# EAGLE board MainECU rev11 (EAGLE 9.6.2)
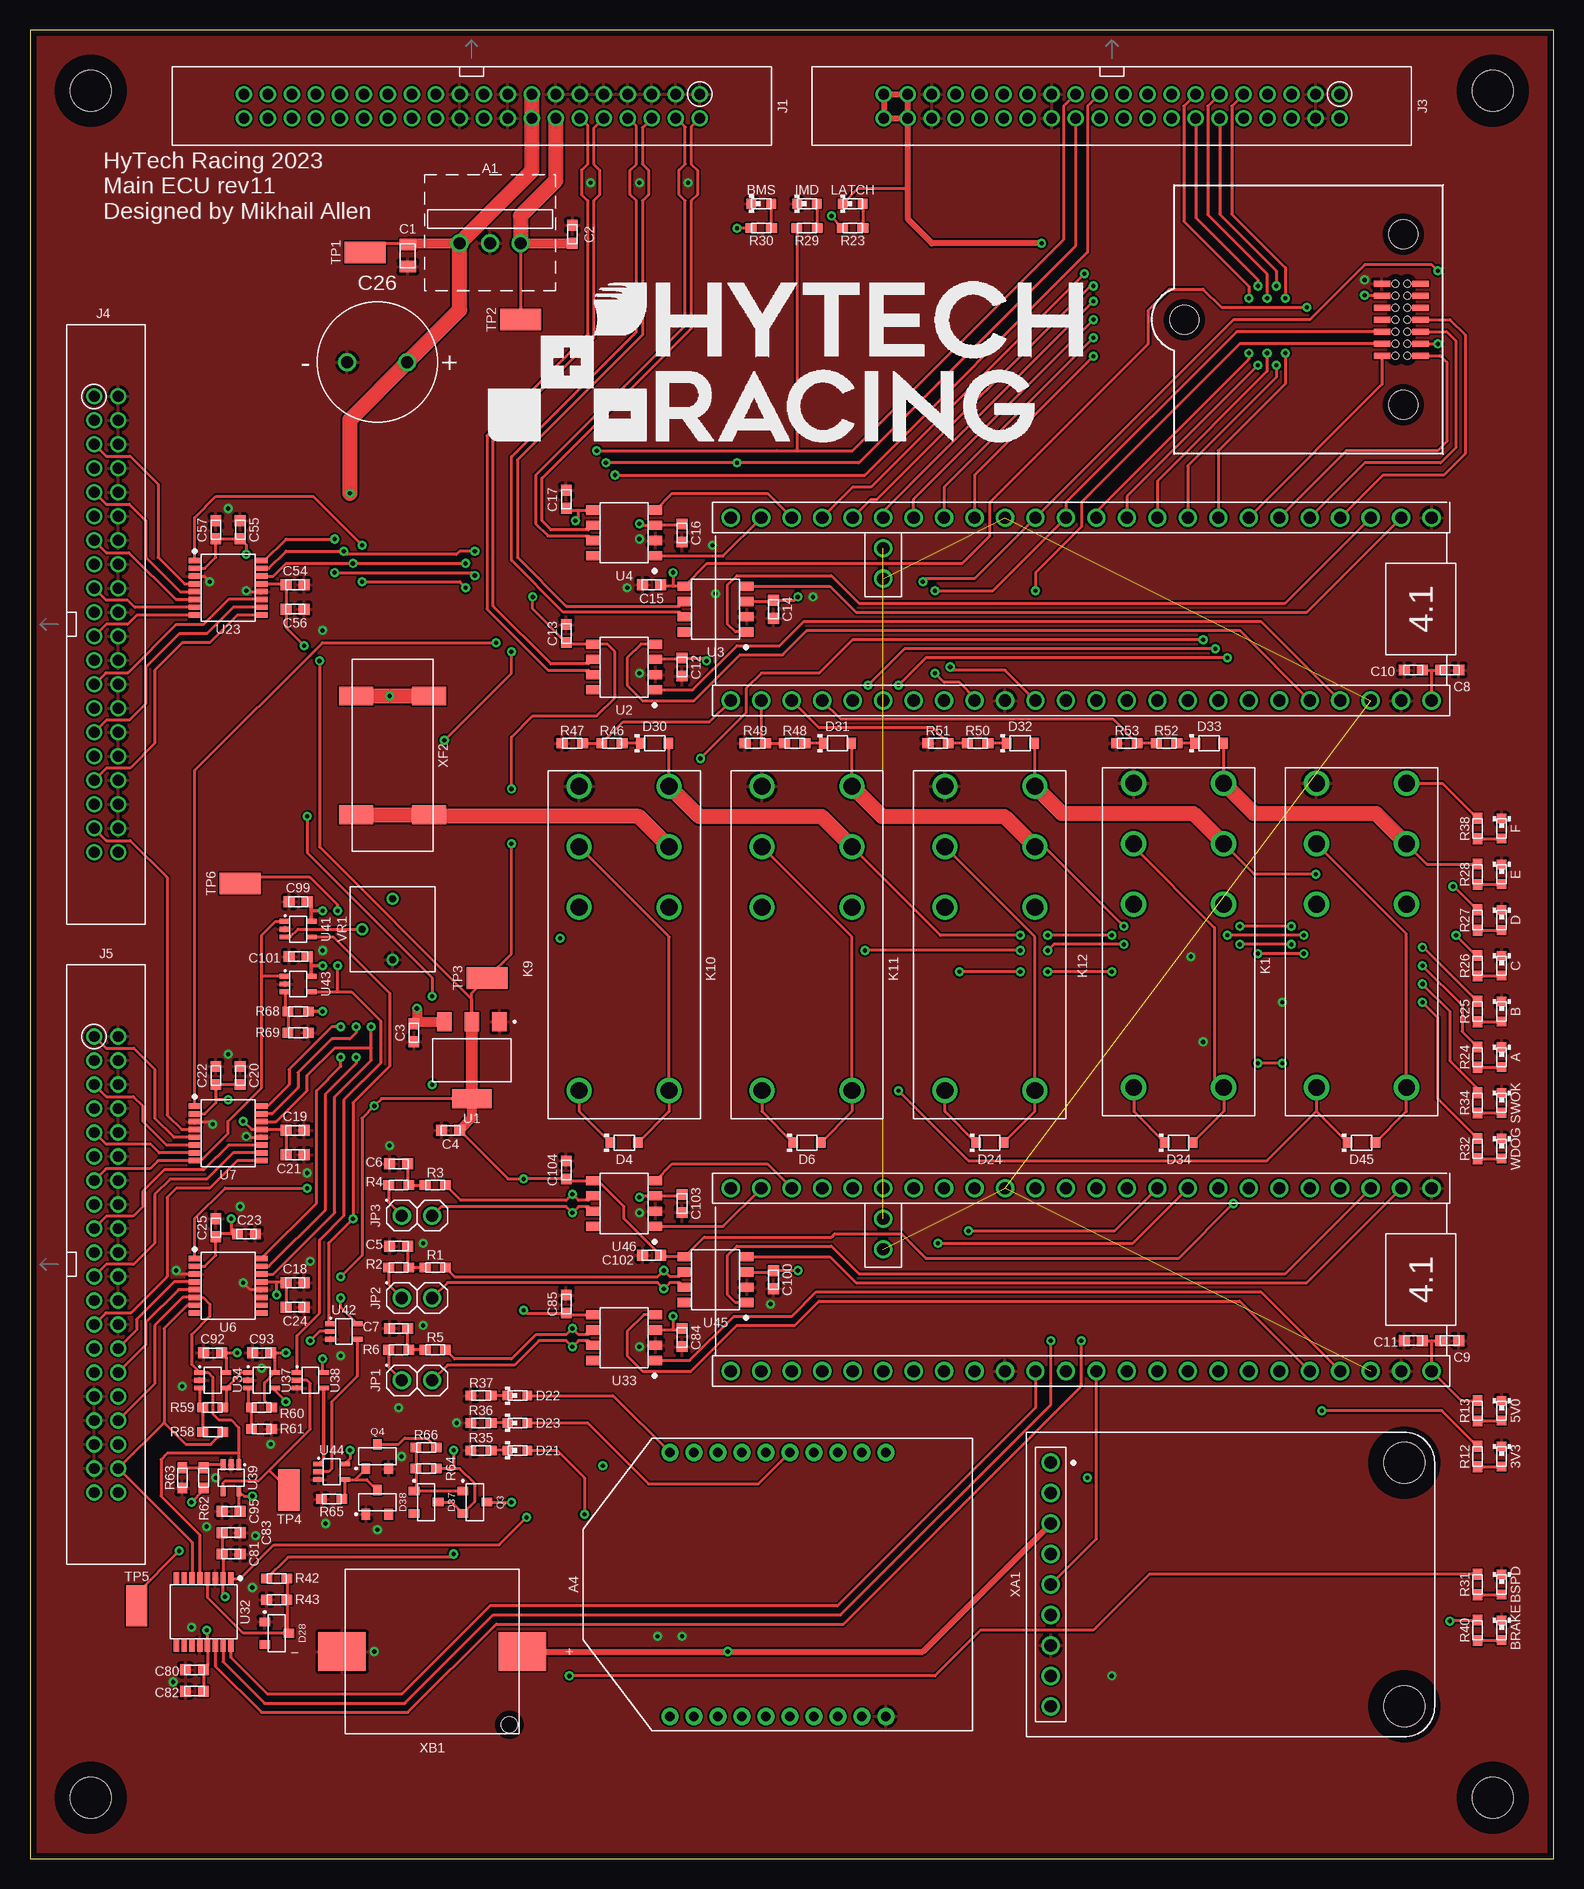
[diagram p6: board, top side]
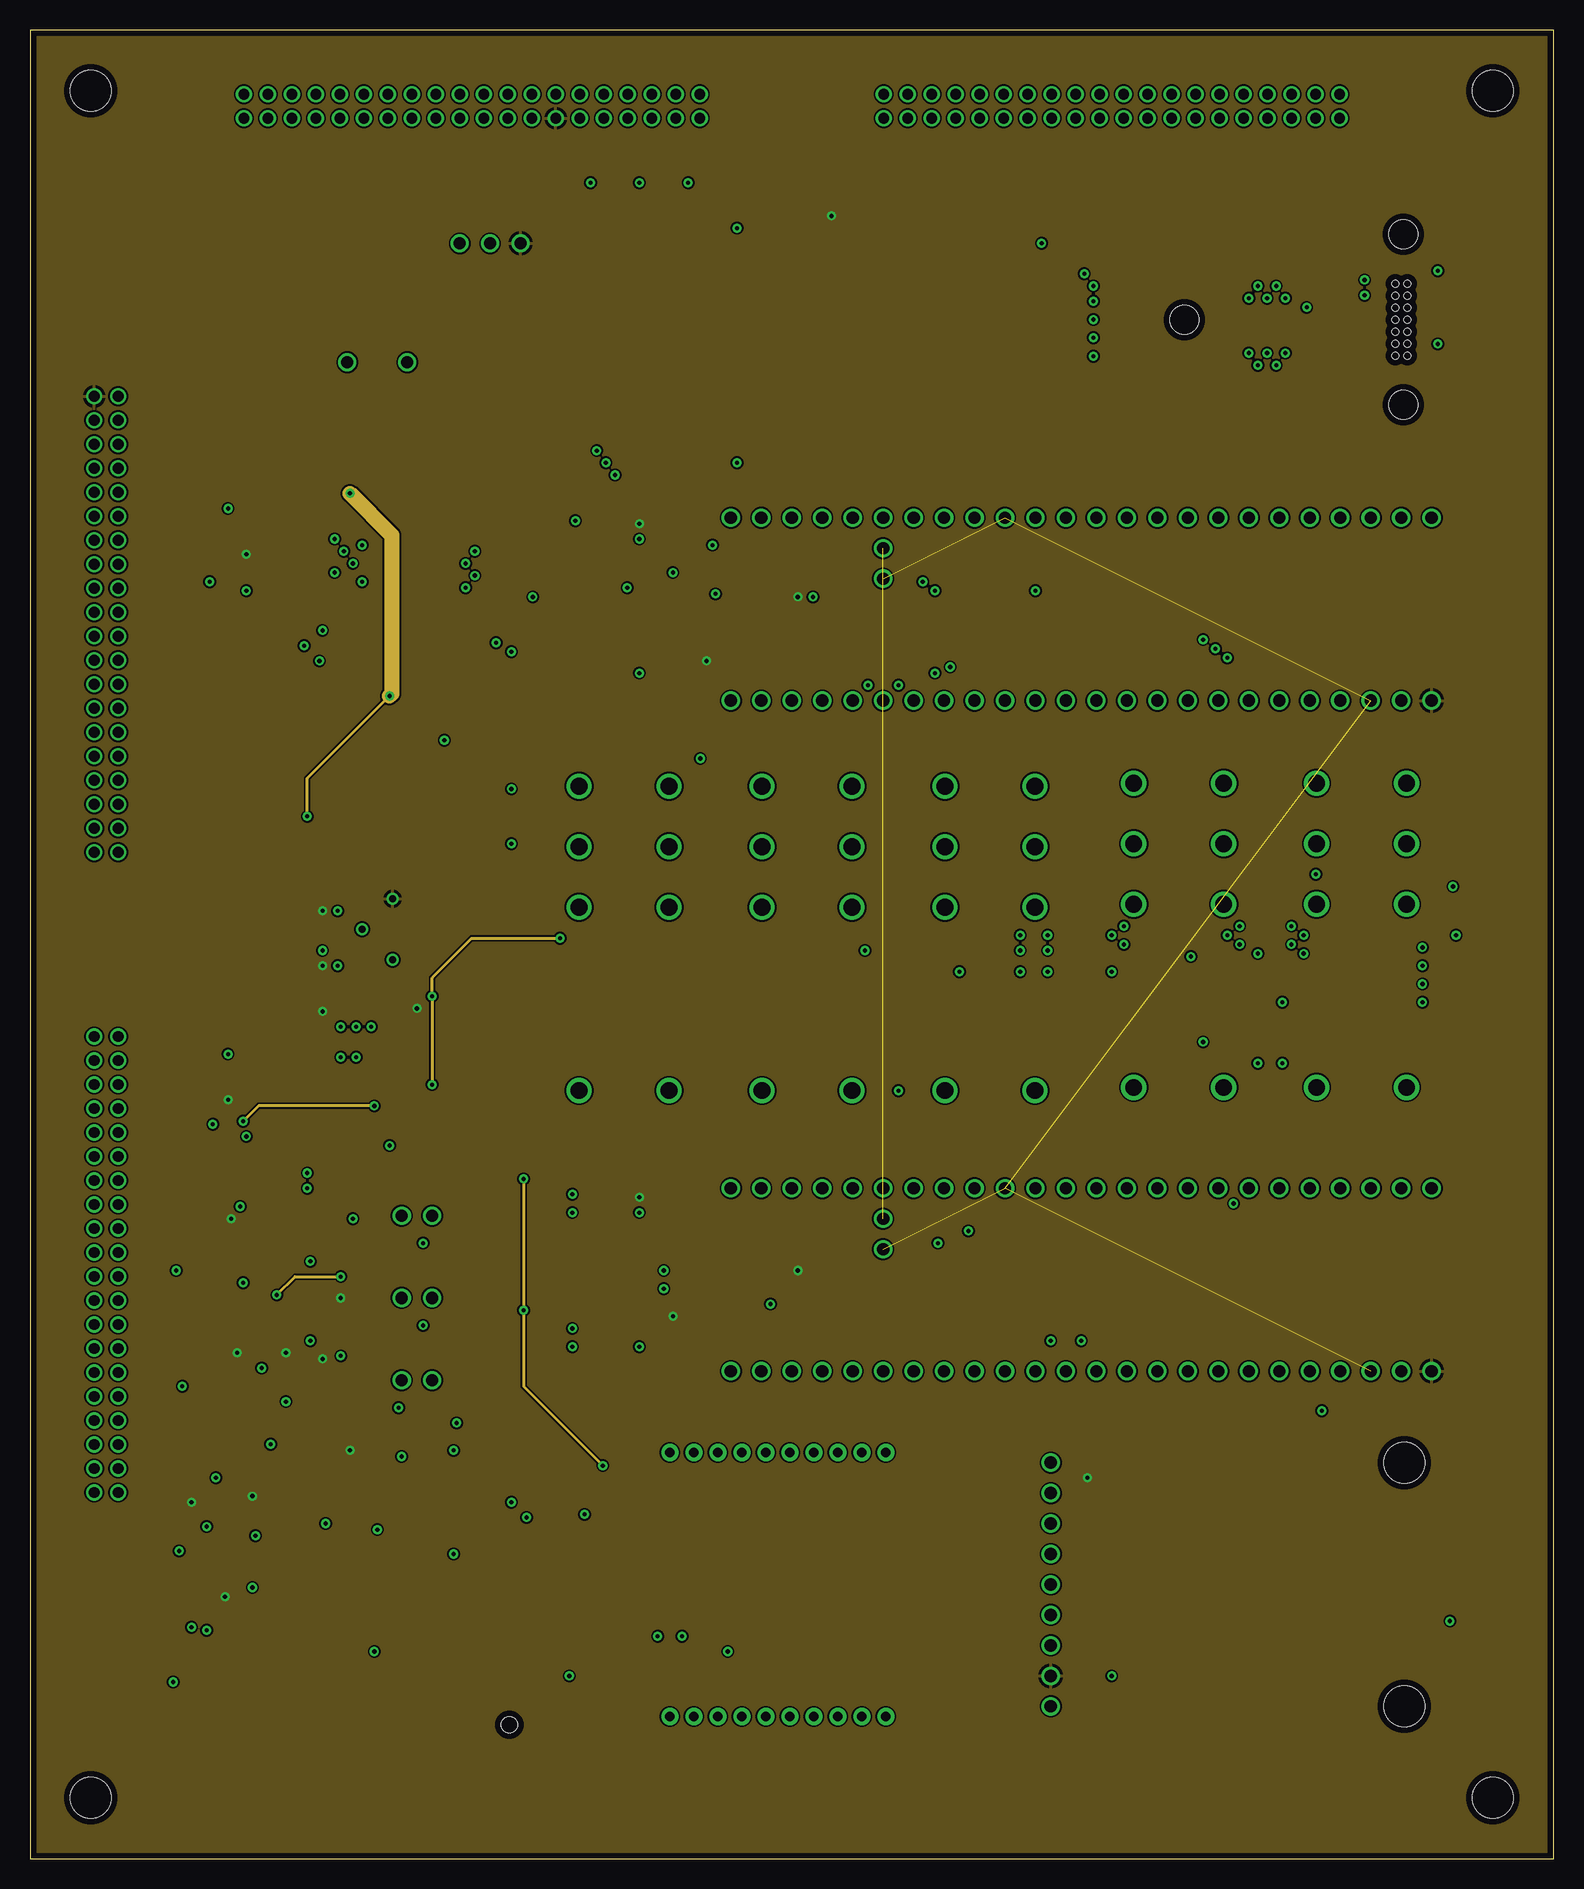
[diagram p7: board, inner layer Route2]
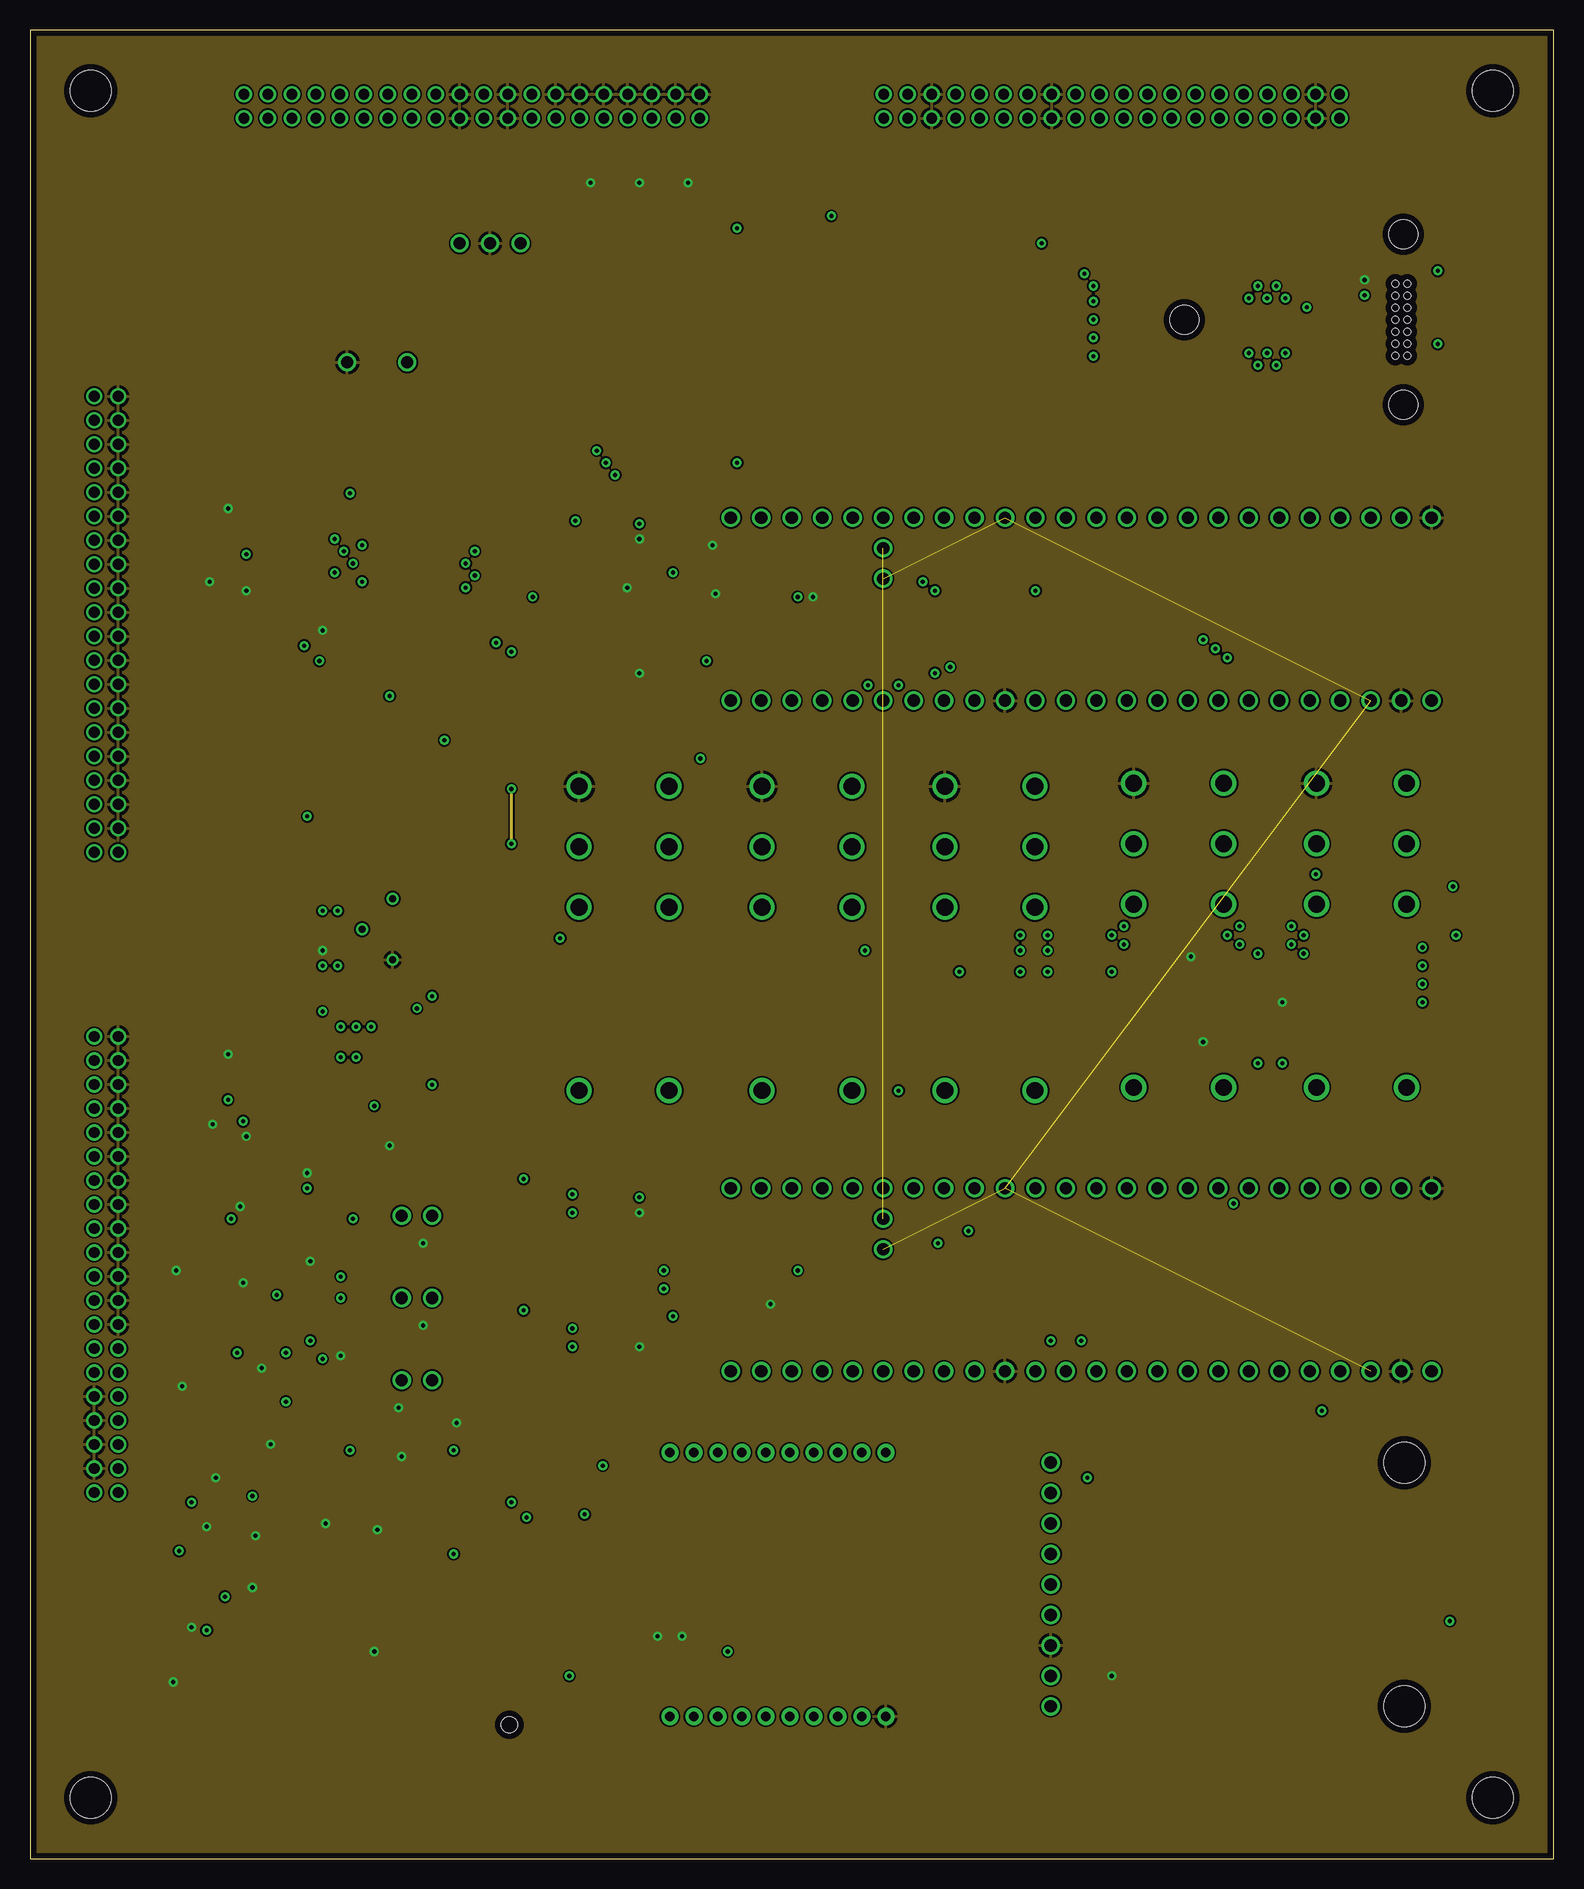
[diagram p8: board, inner layer Route15]
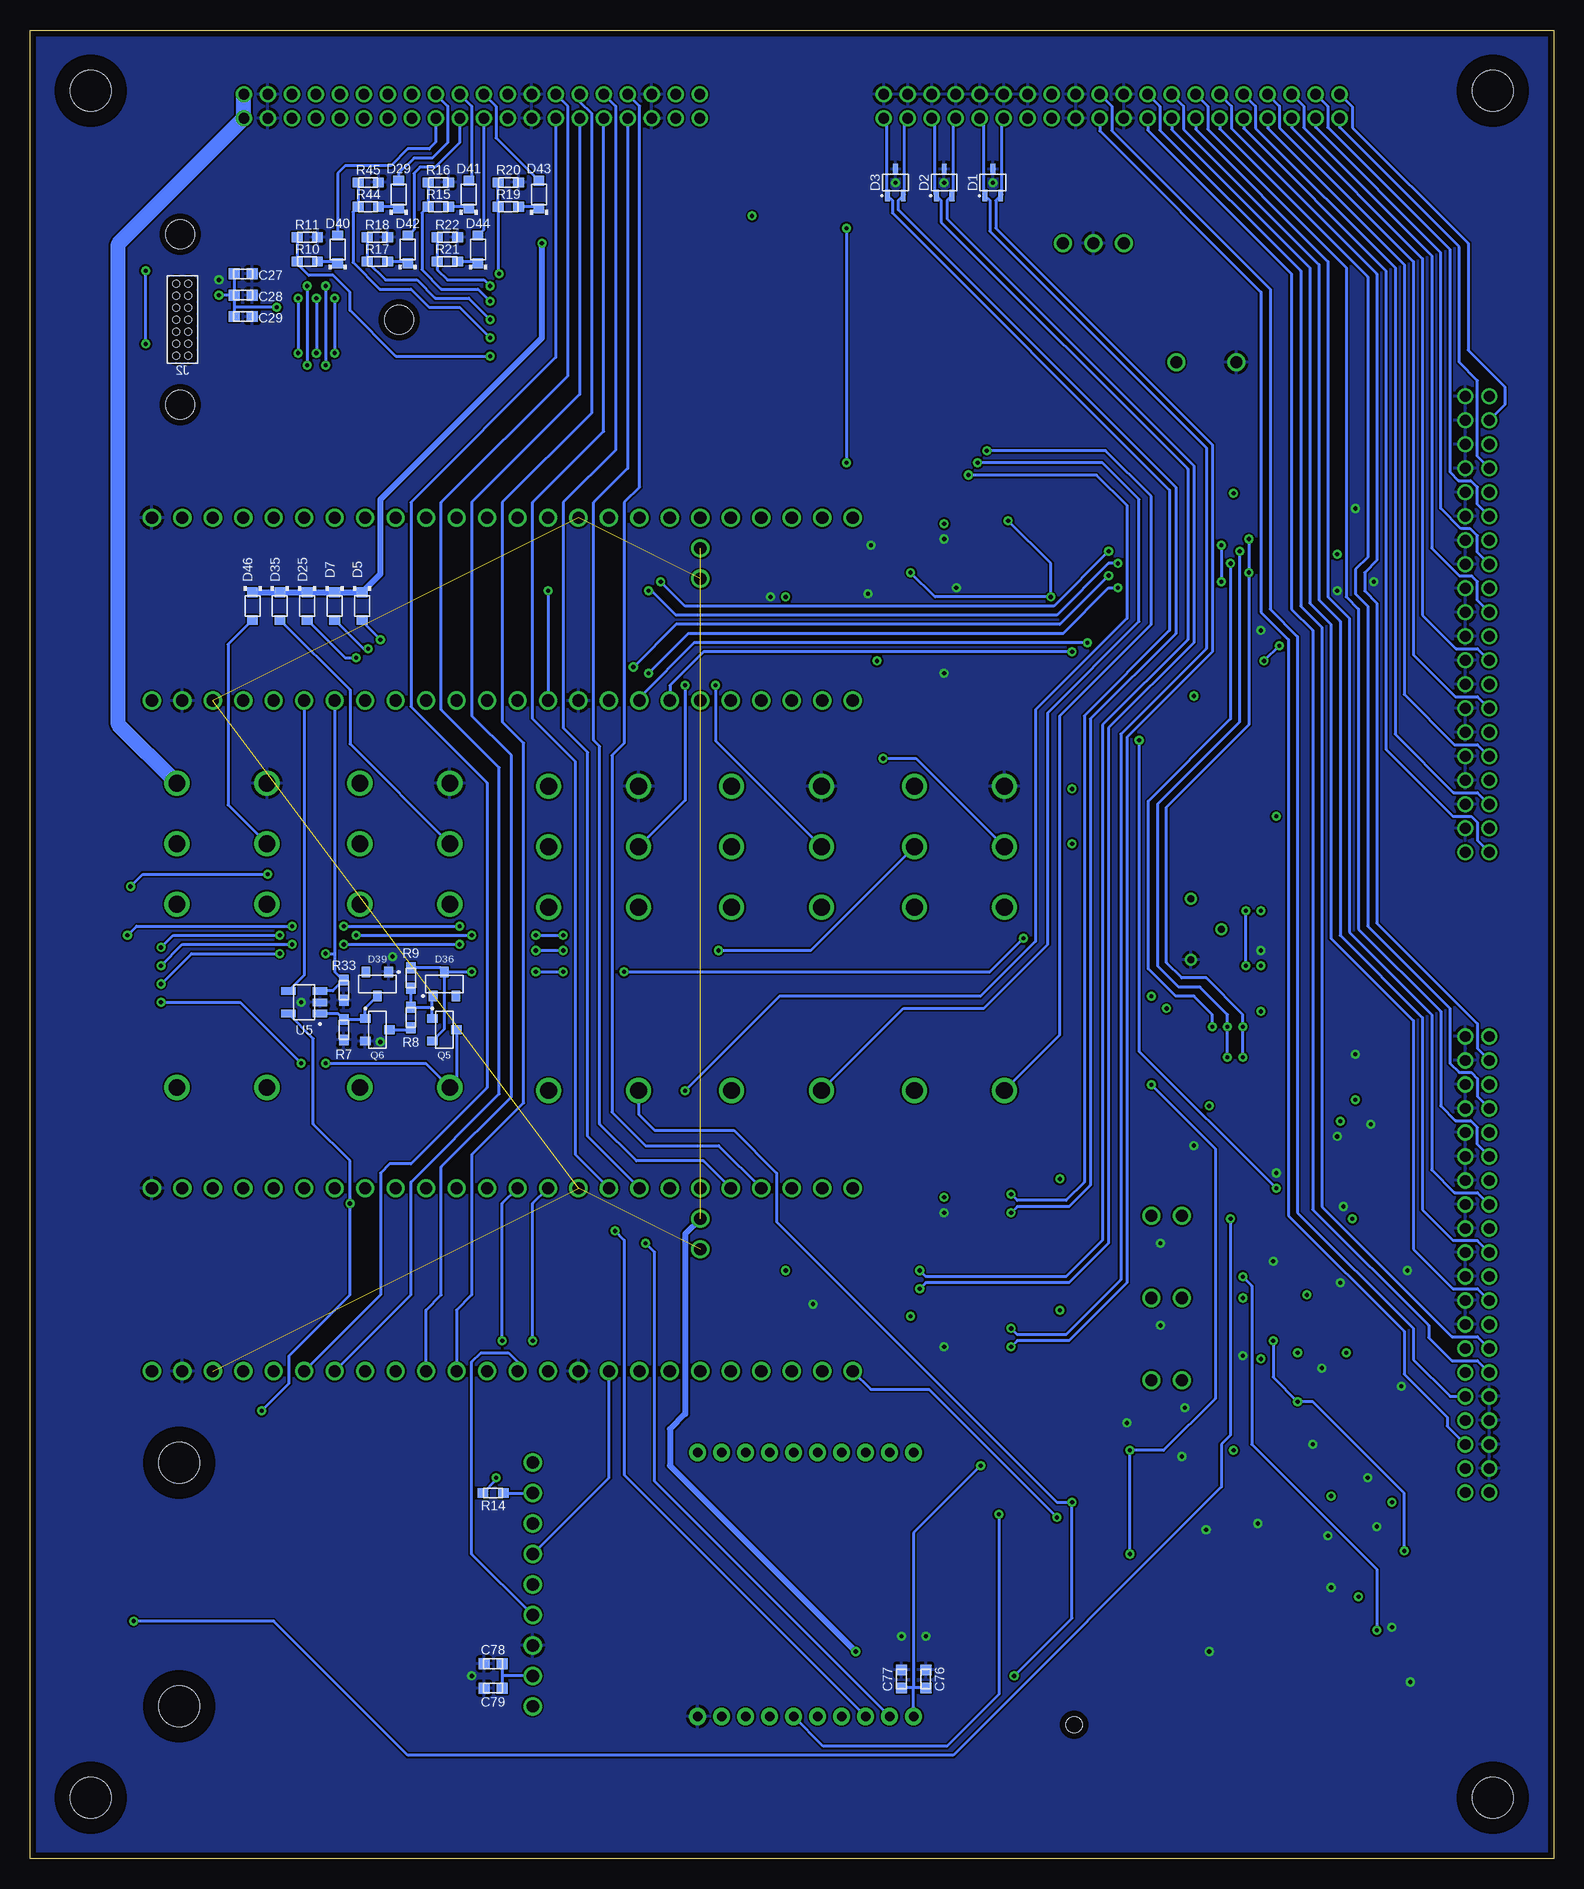
[diagram p9: board, bottom side, seen from below]

Size 127 x 152.4 mm. Coordinates in mm from the lower left corner, seen from the top.
Outline: 0,0 127,0 127,152.4 0,152.4 0,0
Copper layers (1+2*15+16): Top 0.035mm / dielectric 0.2mm / Route2 0.0175mm / dielectric 1.065mm / Route15 0.0175mm / dielectric 0.2mm / Bottom 0.035mm
Design rules "HyTech Default (4 Layer)": minimum track width 6mil, minimum drill 10mil, track to track 6mil, track to pad 6mil, pad to pad 6mil, via to via 20mil, smd to smd 6mil, copper to edge 20mil, drill to drill 21mil, minimum pad ring 8mil, minimum via ring 8mil, stop-mask expansion 3mil, vias tented up to drill 30mil, thermal gap 10mil

## Footprints (pad centres in the part's own frame; a part is rotated, then mirrored left to right if it is on the bottom)
0603-LED = smd 0.8 x 0.8: 1 -0.825,0; 2 0.825,0
OKI-78SR = drill 0.991: 1 -2.54,0; 2 0,0; 3 2.54,0
TEENSY_LONG_EXT = drill 1.016: 3V3 0,5.08; 3V3@2 15.24,35.56; 3V3@3 10.16,45.72; AGND/GND 0,2.54; D0 15.24,2.54; D1 15.24,5.08; D2 15.24,7.62; D3 15.24,10.16; D4 15.24,12.7; D5 15.24,15.24; D6 15.24,17.78; D7 15.24,20.32; D8 15.24,22.86; D9 15.24,25.4; D10 15.24,27.94; D11 15.24,30.48; D12 15.24,33.02; D13 0,33.02; D14 0,30.48; D15 0,27.94; D16 0,25.4; D17 0,22.86; D18 0,20.32; D19 0,17.78; D20 0,15.24; D21 0,12.7; D22 0,10.16; D23 0,7.62; D24 15.24,38.1; D25 15.24,40.64; D26 15.24,43.18; D27 15.24,45.72; D28 15.24,48.26; D29 15.24,50.8; D30 15.24,53.34; D31 15.24,55.88; D32 15.24,58.42; D33 0,58.42; D34 0,55.88; D35 0,53.34; D36 0,50.8; D37 0,48.26; D38 0,45.72; D39 0,43.18; D40 0,40.64; D41 0,38.1; GND 15.24,0; GND@2 0,35.56; VBAT 12.7,45.72; VIN 0,0
XBEE = drill 0.8 pad 1.422: 1 -11,0; 2 -11,-2; 3 -11,-4; 4 -11,-6; 5 -11,-8; 6 -11,-10; 7 -11,-12; 8 -11,-14; 9 -11,-16; 10 -11,-18; 11 11,-18; 12 11,-16; 13 11,-14; 14 11,-12; 15 11,-10; 16 11,-8; 17 11,-6; 18 11,-4; 19 11,-2; 20 11,0
0805-CAP = smd 0.95 x 1.4: 1 -0.925,0; 2 0.925,0
0603-CAP = smd 0.9 x 0.9: 1 -0.75,0; 2 0.75,0
EEH-AZS = drill 1: MINUS 2.5,0; PLUS -2.5,0
SC-70-3 = smd 0.95 x 0.4: 1 -1.1,0.65; 2 -1.1,-0.65; 3 1.1,0
SOD-323 = smd 0.8 x 0.9: A -1.15,0; C 1.15,0
SOT-23 = smd 0.711 x 0.889: 1 -0.94,-1.003; 2 0.94,-1.003; 3 0,1.003
EHT-120-01 = drill 0.9: 1 -19,-1; 2 -19,1; 3 -17,-1; 4 -17,1; 5 -15,-1; 6 -15,1; 7 -13,-1; 8 -13,1; 9 -11,-1; 10 -11,1; 11 -9,-1; 12 -9,1; 13 -7,-1; 14 -7,1; 15 -5,-1; 16 -5,1; 17 -3,-1; 18 -3,1; 19 -1,-1; 20 -1,1; 21 1,-1; 22 1,1; 23 3,-1; 24 3,1; 25 5,-1; 26 5,1; 27 7,-1; 28 7,1; 29 9,-1; 30 9,1; 31 11,-1; 32 11,1; 33 13,-1; 34 13,1; 35 15,-1; 36 15,1; 37 17,-1; 38 17,1; 39 19,-1; 40 19,1
ADIS16460 = smd 0.5 x 1.37: 1 -3,1.6; 2 -3,-1.6; 3 -2,1.6; 4 -2,-1.6; 5 -1,1.6; 6 -1,-1.6; 7 0,1.6; 8 0,-1.6; 9 1,1.6; 10 1,-1.6; 11 2,1.6; 12 2,-1.6; 13 3,1.6; 14 3,-1.6 | hole 0.56: 0,-0.5; 0,0.5; -1,0.5; -1,-0.5; -2,0.5; -2,-0.5; 1,0.5; 1,-0.5; 2,0.5; 2,-0.5; -3,0.5; -3,-0.5; 3,0.5; 3,-0.5 | hole 2.4: -7.1,-0.19; 7.1,-0.19; 0,18.06
1X02 = drill 1.016: 1 -1.27,0; 2 1.27,0
RT*2* = drill 1.4: 11 0,3.75; 12 -5.04,3.75; 14 5.04,3.75; 21 0,-3.75; 22 -5.04,-3.75; 24 5.04,-3.75; A1 -20.3,3.75; A2 -20.3,-3.75
0603-RES = smd 0.9 x 0.8: 1 -0.85,0; 2 0.85,0
5015 = smd 3.429 x 1.778: 1 0,0
SOT-223 = smd 1.2 x 1.6: 1 -2.3,-3.2; 2 0,-3.2; 3 2.3,-3.2 | smd 3.3 x 1.6: 4 0,3.2
SOIC-08(NARROW,0.15") = smd 0.762 x 1.143: 1 -1.905,-2.603; 2 -0.635,-2.603; 3 0.635,-2.603; 4 1.905,-2.603; 5 1.905,2.603; 6 0.635,2.603; 7 -0.635,2.603; 8 -1.905,2.603
SOT-23-5 = smd 0.62 x 1.22: 1 -0.95,-1.31; 2 0,-1.31; 3 0.95,-1.31; 4 0.95,1.31; 5 -0.95,1.31
TSSOP-16 = smd 0.45 x 1.05: 1 -2.275,-2.775; 2 -1.625,-2.775; 3 -0.975,-2.775; 4 -0.325,-2.775; 5 0.325,-2.775; 6 0.975,-2.775; 7 1.625,-2.775; 8 2.275,-2.775; 9 2.275,2.775; 10 1.625,2.775; 11 0.975,2.775; 12 0.325,2.775; 13 -0.325,2.775; 14 -0.975,2.775; 15 -1.625,2.775; 16 -2.275,2.775
SC-70-5 = smd 0.4 x 0.9: 1 -0.65,-1.1; 2 0,-1.1; 3 0.65,-1.1; 4 0.65,1.1; 5 -0.65,1.1
MOUNTING_M3 = hole 3.4: 0,0
3362P = drill 0.6: 1 -2.54,0; 2 0,2.54; 3 2.54,0
ULTIMATE_GPS = drill 1.016: 3.3V -10.16,0; EN -7.62,0; FIX -2.54,0; GND 5.08,0; PPS 10.16,0; RX 2.54,0; TX 0,0; VBAT -5.08,0; VIN 7.62,0 | hole 3.4: -10.16,29.464; 10.16,29.464
498 = smd 3.962 x 3.175: 1 -7.518,0; 2 7.518,0 | hole 1.346: -6.426,6.096
3588 = smd 1.575 x 2.819: 1 -4.953,3.035; 2 -4.953,-3.035; 3 4.953,-3.035; 4 4.953,3.035

## Placement (x,y rotation side)
3V3  LED_0603_RED  [0603-LED]  122.68,33.53 270 top
5V0  LED_0603_RED  [0603-LED]  122.68,37.34 270 top
A  LED_0603_BLUE  [0603-LED]  122.68,66.8 270 top
A1  VOLTAGE_REGULATOR_MODULE_OKI-78SR_5V  [OKI-78SR]  38.35,134.62 0 top
A2  TEENSY_4.1  [TEENSY_LONG_EXT]  116.84,96.52 90 top
A3  TEENSY_4.1  [TEENSY_LONG_EXT]  116.84,40.64 90 top
A4  XB3-C-A2-UT-001  [XBEE]  53.34,22.86 90 top
B  LED_0603_GREEN  [0603-LED]  122.68,70.61 270 top
BMS  LED_0603_YELLOW  [0603-LED]  60.96,137.92 0 top
BRAKE  LED_0603_YELLOW  [0603-LED]  122.68,19.05 270 top
BSPD  LED_0603_ORANGE  [0603-LED]  122.68,22.86 270 top
C  LED_0603_YELLOW  [0603-LED]  122.68,74.42 270 top
C1  CAPACITOR_0805_50V_10UF  [0805-CAP]  31.5,133.6 270 top
C2  CAPACITOR_0603_25V_10UF  [0603-CAP]  45.21,135.38 90 top
C3  CAPACITOR_0603_25V_10UF  [0603-CAP]  32,68.83 270 top
C4  CAPACITOR_0603_25V_10UF  [0603-CAP]  35.05,60.71 180 top
C5  CAPACITOR_0603_10V_4.7NF  [0603-CAP]  30.73,51.05 180 top
C6  CAPACITOR_0603_10V_4.7NF  [0603-CAP]  30.73,57.91 180 top
C7  CAPACITOR_0603_10V_4.7NF  [0603-CAP]  30.73,44.2 180 top
C8  CAPACITOR_0603_10V_0.1UF  [0603-CAP]  118.36,99.06 0 top
C9  CAPACITOR_0603_10V_0.1UF  [0603-CAP]  118.36,43.18 0 top
C10  CAPACITOR_0603_10V_1UF  [0603-CAP]  115.32,99.06 180 top
C11  CAPACITOR_0603_10V_1UF  [0603-CAP]  115.32,43.18 180 top
C12  CAPACITOR_0603_10V_0.1UF  [0603-CAP]  54.36,99.31 270 top
C13  CAPACITOR_0603_10V_0.1UF  [0603-CAP]  44.7,102.11 90 top
C14  CAPACITOR_0603_10V_0.1UF  [0603-CAP]  61.98,104.14 270 top
C15  CAPACITOR_0603_10V_0.1UF  [0603-CAP]  51.82,106.17 180 top
C16  CAPACITOR_0603_10V_0.1UF  [0603-CAP]  54.36,110.49 270 top
C17  CAPACITOR_0603_10V_0.1UF  [0603-CAP]  44.7,113.28 90 top
C18  CAPACITOR_0603_10V_0.1UF  [0603-CAP]  22.1,48.01 0 top
C19  CAPACITOR_0603_10V_0.1UF  [0603-CAP]  22.1,60.71 0 top
C20  CAPACITOR_0603_10V_0.1UF  [0603-CAP]  17.53,65.28 90 top
C21  CAPACITOR_0603_10V_1UF  [0603-CAP]  22.1,58.67 0 top
C22  CAPACITOR_0603_10V_1UF  [0603-CAP]  15.49,65.28 90 top
C23  CAPACITOR_0603_10V_0.1UF  [0603-CAP]  18.03,52.07 0 top
C24  CAPACITOR_0603_10V_1UF  [0603-CAP]  22.1,45.97 0 top
C25  CAPACITOR_0603_10V_1UF  [0603-CAP]  15.49,52.58 90 top
C26  EEH-AZS1V471B  [EEH-AZS]  28.96,124.71 180 top
C27  CAPACITOR_0603_25V_10UF  [0603-CAP]  109.22,132.08 0 bottom
C28  CAPACITOR_0603_25V_1UF  [0603-CAP]  109.22,130.3 0 bottom
C29  CAPACITOR_0603_25V_0.1UF  [0603-CAP]  109.22,128.52 0 bottom
C54  CAPACITOR_0603_10V_0.1UF  [0603-CAP]  22.1,106.17 0 top
C55  CAPACITOR_0603_10V_0.1UF  [0603-CAP]  17.53,110.74 90 top
C56  CAPACITOR_0603_10V_1UF  [0603-CAP]  22.1,104.14 0 top
C57  CAPACITOR_0603_10V_1UF  [0603-CAP]  15.49,110.74 90 top
C76  CAPACITOR_0603_10V_0.1UF  [0603-CAP]  52.32,14.99 90 bottom
C77  CAPACITOR_0603_10V_1UF  [0603-CAP]  54.36,14.99 90 bottom
C78  CAPACITOR_0603_10V_0.1UF  [0603-CAP]  88.39,16.26 180 bottom
C79  CAPACITOR_0603_10V_1UF  [0603-CAP]  88.39,14.22 180 bottom
C80  CAPACITOR_0603_10V_0.1UF  [0603-CAP]  13.72,15.75 180 top
C81  CAPACITOR_0603_10V_0.1UF  [0603-CAP]  16.76,25.4 0 top
C82  CAPACITOR_0603_10V_1UF  [0603-CAP]  13.72,13.97 180 top
C83  CAPACITOR_0603_10V_1UF  [0603-CAP]  16.76,27.18 0 top
C84  CAPACITOR_0603_10V_0.1UF  [0603-CAP]  54.36,43.43 270 top
C85  CAPACITOR_0603_10V_0.1UF  [0603-CAP]  44.7,46.23 90 top
C92  CAPACITOR_0603_10V_0.1UF  [0603-CAP]  15.24,42.16 180 top
C93  CAPACITOR_0603_10V_0.1UF  [0603-CAP]  19.3,42.16 180 top
C95  CAPACITOR_0603_10V_0.1UF  [0603-CAP]  16.76,28.96 180 top
C99  CAPACITOR_0603_10V_0.1UF  [0603-CAP]  22.35,79.76 180 top
C100  CAPACITOR_0603_10V_0.1UF  [0603-CAP]  61.98,48.26 270 top
C101  CAPACITOR_0603_10V_0.1UF  [0603-CAP]  22.35,75.18 180 top
C102  CAPACITOR_0603_10V_0.1UF  [0603-CAP]  51.82,50.29 180 top
C103  CAPACITOR_0603_10V_0.1UF  [0603-CAP]  54.36,54.61 270 top
C104  CAPACITOR_0603_10V_0.1UF  [0603-CAP]  44.7,57.4 90 top
D  LED_0603_ORANGE  [0603-LED]  122.68,78.23 270 top
D1  TVS_BIDIRECTIONAL_DUAL  [SC-70-3]  46.74,139.7 90 bottom
D2  TVS_BIDIRECTIONAL_DUAL  [SC-70-3]  50.8,139.7 90 bottom
D3  TVS_BIDIRECTIONAL_DUAL  [SC-70-3]  54.86,139.7 90 bottom
D4  SCHOTTKY_SOD323_30V  [SOD-323]  49.53,59.69 180 top
D5  SCHOTTKY_SOD323_30V  [SOD-323]  99.31,104.39 90 bottom
D6  SCHOTTKY_SOD323_30V  [SOD-323]  64.77,59.69 180 top
D7  SCHOTTKY_SOD323_30V  [SOD-323]  101.6,104.39 90 bottom
D21  LED_0603_YELLOW  [0603-LED]  40.64,34.04 0 top
D22  LED_0603_ORANGE  [0603-LED]  40.64,38.61 0 top
D23  LED_0603_RED  [0603-LED]  40.64,36.32 0 top
D24  SCHOTTKY_SOD323_30V  [SOD-323]  80.01,59.69 180 top
D25  SCHOTTKY_SOD323_30V  [SOD-323]  103.89,104.39 90 bottom
D28  TVS_5V  [SOT-23]  20.57,18.8 270 top
D29  SCHOTTKY_SOD323_30V  [SOD-323]  96.27,138.68 270 bottom
D30  SCHOTTKY_SOD323_30V  [SOD-323]  52.07,92.96 180 top
D31  SCHOTTKY_SOD323_30V  [SOD-323]  67.31,92.96 180 top
D32  SCHOTTKY_SOD323_30V  [SOD-323]  82.55,92.96 180 top
D33  SCHOTTKY_SOD323_30V  [SOD-323]  98.3,92.96 180 top
D34  SCHOTTKY_SOD323_30V  [SOD-323]  95.76,59.69 180 top
D35  SCHOTTKY_SOD323_30V  [SOD-323]  106.17,104.39 90 bottom
D36  TVS_15V  [SOT-23]  92.46,72.9 0 bottom
D37  TVS_15V  [SOT-23]  33.02,29.72 270 top
D38  TVS_15V  [SOT-23]  28.96,29.72 0 top
D39  TVS_15V  [SOT-23]  98.04,72.9 180 bottom
D40  SCHOTTKY_SOD323_30V  [SOD-323]  101.35,134.11 270 bottom
D41  SCHOTTKY_SOD323_30V  [SOD-323]  90.42,138.68 270 bottom
D42  SCHOTTKY_SOD323_30V  [SOD-323]  95.5,134.11 270 bottom
D43  SCHOTTKY_SOD323_30V  [SOD-323]  84.58,138.68 270 bottom
D44  SCHOTTKY_SOD323_30V  [SOD-323]  89.66,134.11 270 bottom
D45  SCHOTTKY_SOD323_30V  [SOD-323]  111,59.69 180 top
D46  SCHOTTKY_SOD323_30V  [SOD-323]  108.46,104.39 90 bottom
E  LED_0603_RED  [0603-LED]  122.68,82.04 270 top
F  LED_0603_RED  [0603-LED]  122.68,85.85 270 top
IMD  LED_0603_GREEN  [0603-LED]  64.77,137.92 0 top
J1  CONNECTOR-40__  [EHT-120-01]  36.83,146.05 180 top
J2  ADIS16460  [ADIS16460]  114.3,128.27 90 top
J3  CONNECTOR-40__  [EHT-120-01]  90.17,146.05 180 top
J4  CONNECTOR-40__  [EHT-120-01]  6.35,102.87 270 top
J5  CONNECTOR-40__  [EHT-120-01]  6.35,49.53 270 top
JP1  JUMPER__1X02  [1X02]  32.26,39.88 0 top
JP2  JUMPER__1X02  [1X02]  32.26,46.74 0 top
JP3  JUMPER__1X02  [1X02]  32.26,53.59 0 top
K1  RELAY_DPDT_RT424024  [RT*2*]  111,84.58 90 top
K9  RELAY_DPDT_RT424024  [RT*2*]  49.53,84.33 90 top
K10  RELAY_DPDT_RT424024  [RT*2*]  64.77,84.33 90 top
K11  RELAY_DPDT_RT424024  [RT*2*]  80.01,84.33 90 top
K12  RELAY_DPDT_RT424024  [RT*2*]  95.76,84.58 90 top
LATCH  LED_0603_WHITE  [0603-LED]  68.58,137.92 0 top
Q3  TRANSISTOR_P_MOS_SOT-23_DMP3056L-7  [SOT-23]  37.08,29.72 270 top
Q4  TRANSISTOR_N_MOS__DMG3406L-7  [SOT-23]  28.96,33.53 0 top
Q5  TRANSISTOR_P_MOS_SOT-23_DMP3056L-7  [SOT-23]  92.46,69.09 270 bottom
Q6  TRANSISTOR_N_MOS__DMG3406L-7  [SOT-23]  98.04,69.09 270 bottom
R1  RESISTOR_0603_60.4  [0603-RES]  33.78,49.28 180 top
R2  RESISTOR_0603_60.4  [0603-RES]  30.73,49.28 180 top
R3  RESISTOR_0603_60.4  [0603-RES]  33.78,56.13 180 top
R4  RESISTOR_0603_60.4  [0603-RES]  30.73,56.13 180 top
R5  RESISTOR_0603_60.4  [0603-RES]  33.78,42.42 180 top
R6  RESISTOR_0603_60.4  [0603-RES]  30.73,42.42 180 top
R7  RESISTOR_0603_10K  [0603-RES]  100.84,69.09 90 bottom
R8  RESISTOR_0603_5.1K  [0603-RES]  95.25,70.1 90 bottom
R9  RESISTOR_0603_5.1K  [0603-RES]  95.25,73.41 90 bottom
R10  RESISTOR_0603_10K  [0603-RES]  103.89,133.1 0 bottom
R11  RESISTOR_0603_1.33K  [0603-RES]  103.89,135.13 180 bottom
R12  RESISTOR_0603_100  [0603-RES]  120.65,33.53 270 top
R13  RESISTOR_0603_240  [0603-RES]  120.65,37.34 270 top
R14  RESISTOR_0603_10K  [0603-RES]  88.39,30.48 180 bottom
R15  RESISTOR_0603_10K  [0603-RES]  92.96,137.67 0 bottom
R16  RESISTOR_0603_1.33K  [0603-RES]  92.96,139.7 180 bottom
R17  RESISTOR_0603_10K  [0603-RES]  98.04,133.1 0 bottom
R18  RESISTOR_0603_1.33K  [0603-RES]  98.04,135.13 180 bottom
R19  RESISTOR_0603_10K  [0603-RES]  87.12,137.67 0 bottom
R20  RESISTOR_0603_1.33K  [0603-RES]  87.12,139.7 180 bottom
R21  RESISTOR_0603_10K  [0603-RES]  92.2,133.1 0 bottom
R22  RESISTOR_0603_1.33K  [0603-RES]  92.2,135.13 180 bottom
R23  RESISTOR_0603_100  [0603-RES]  68.58,135.89 180 top
R24  RESISTOR_0603_2K  [0603-RES]  120.65,66.8 270 top
R25  RESISTOR_0603_2K  [0603-RES]  120.65,70.61 270 top
R26  RESISTOR_0603_2K  [0603-RES]  120.65,74.42 270 top
R27  RESISTOR_0603_2K  [0603-RES]  120.65,78.23 270 top
R28  RESISTOR_0603_2K  [0603-RES]  120.65,82.04 270 top
R29  RESISTOR_0603_2K  [0603-RES]  64.77,135.89 0 top
R30  RESISTOR_0603_2K  [0603-RES]  60.96,135.89 0 top
R31  RESISTOR_0603_2K  [0603-RES]  120.65,22.86 270 top
R32  RESISTOR_0603_2K  [0603-RES]  120.65,59.18 270 top
R33  RESISTOR_0603_10K  [0603-RES]  100.84,72.39 90 bottom
R34  RESISTOR_0603_100  [0603-RES]  120.65,62.99 270 top
R35  RESISTOR_0603_60.4  [0603-RES]  37.59,34.04 0 top
R36  RESISTOR_0603_60.4  [0603-RES]  37.59,36.32 0 top
R37  RESISTOR_0603_60.4  [0603-RES]  37.59,38.61 0 top
R38  RESISTOR_0603_2K  [0603-RES]  120.65,85.85 270 top
R40  RESISTOR_0603_180  [0603-RES]  120.65,19.05 270 top
R42  RESISTOR_0603_10K  [0603-RES]  20.57,23.37 180 top
R43  RESISTOR_0603_2.55K  [0603-RES]  20.57,21.59 0 top
R44  RESISTOR_0603_10K  [0603-RES]  98.81,137.67 0 bottom
R45  RESISTOR_0603_1.33K  [0603-RES]  98.81,139.7 180 bottom
R46  RESISTOR_0603_10K  [0603-RES]  48.51,92.96 0 top
R47  RESISTOR_0603_1.33K  [0603-RES]  45.21,92.96 0 top
R48  RESISTOR_0603_10K  [0603-RES]  63.75,92.96 0 top
R49  RESISTOR_0603_1.33K  [0603-RES]  60.45,92.96 0 top
R50  RESISTOR_0603_10K  [0603-RES]  78.99,92.96 0 top
R51  RESISTOR_0603_1.33K  [0603-RES]  75.69,92.96 0 top
R52  RESISTOR_0603_10K  [0603-RES]  94.74,92.96 0 top
R53  RESISTOR_0603_1.33K  [0603-RES]  91.44,92.96 0 top
R58  RESISTOR_0603_1K  [0603-RES]  15.24,35.56 180 top
R59  RESISTOR_0603_41.2K  [0603-RES]  15.24,37.59 0 top
R60  RESISTOR_0603_10K  [0603-RES]  19.3,37.59 0 top
R61  RESISTOR_0603_10K  [0603-RES]  19.3,35.81 180 top
R62  RESISTOR_0603_1.13K  [0603-RES]  14.48,31.75 270 top
R63  RESISTOR_0603_10.2K  [0603-RES]  12.7,31.75 90 top
R64  RESISTOR_0603_5.1K  [0603-RES]  33.02,32.51 0 top
R65  RESISTOR_0603_10K  [0603-RES]  25.15,29.97 0 top
R66  RESISTOR_0603_5.1K  [0603-RES]  33.02,34.29 180 top
R68  RESISTOR_0603_1.13K  [0603-RES]  22.35,70.61 0 top
R69  RESISTOR_0603_10.2K  [0603-RES]  22.35,68.83 180 top
SWOK  LED_0603_RED  [0603-LED]  122.68,62.99 270 top
TP1  TEST_POINT  [5015]  27.94,133.86 0 top
TP2  TEST_POINT  [5015]  40.89,128.27 0 top
TP3  TEST_POINT  [5015]  38.1,73.41 0 top
TP4  TEST_POINT  [5015]  21.59,30.73 90 top
TP5  TEST_POINT  [5015]  8.89,21.08 270 top
TP6  TEST_POINT  [5015]  17.53,81.28 0 top
U1  VOLTAGE_REGULATOR_SOT-223_3.3V  [SOT-223]  36.83,66.55 180 top
U2  TCAN1051HQV-Q1  [SOIC-08(NARROW,0.15")]  49.53,99.31 90 top
U3  TCAN1051HQV-Q1  [SOIC-08(NARROW,0.15")]  57.15,104.14 90 top
U4  TCAN1051HQV-Q1  [SOIC-08(NARROW,0.15")]  49.53,110.49 90 top
U5  ADM8316WBX30  [SOT-23-5]  104.14,71.37 90 bottom
U6  ADC128S022  [TSSOP-16]  16.51,47.75 270 top
U7  ADC128S022  [TSSOP-16]  16.51,60.45 270 top
U23  ADC128S022  [TSSOP-16]  16.51,105.92 270 top
U32  ADC128S022  [TSSOP-16]  14.48,20.57 180 top
U33  TCAN1051HQV-Q1  [SOIC-08(NARROW,0.15")]  49.53,43.43 90 top
U34  OPAMP_1_CHANNEL_OPA991  [SC-70-5]  15.24,39.88 270 top
U37  OPAMP_1_CHANNEL_OPA991  [SC-70-5]  19.3,39.88 270 top
U38  LOGICGATE_OR  [SC-70-5]  23.37,39.88 270 top
U39  OPAMP_1_CHANNEL_OPA991  [SC-70-5]  16.76,31.75 180 top
U41  OPAMP_1_CHANNEL_OPA991  [SC-70-5]  22.35,77.47 270 top
U42  LOGICGATE_AND_DCK3  [SC-70-5]  26.16,43.94 270 top
U43  OPAMP_1_CHANNEL_OPA991  [SC-70-5]  22.35,72.9 270 top
U44  LOGICGATE_NOR  [SC-70-5]  25.15,32.26 270 top
U45  TCAN1051HQV-Q1  [SOIC-08(NARROW,0.15")]  57.15,48.26 90 top
U46  TCAN1051HQV-Q1  [SOIC-08(NARROW,0.15")]  49.53,54.61 90 top
U$5  [LOGO_HYTECH_LARGE]  38.1,118.11 0 top
U$9  [MOUNTING_M3]  5.08,147.32 0 top
U$10  [MOUNTING_M3]  5.08,5.08 0 top
U$11  [MOUNTING_M3]  121.92,147.32 0 top
U$12  [MOUNTING_M3]  121.92,5.08 0 top
VR1  RESISTOR_TRIMPOT_10K_3362P  [3362P]  30.23,77.47 90 top
WDOG  LED_0603_RED  [0603-LED]  122.68,59.18 270 top
XA1  ULTIMATE_GPS  [ULTIMATE_GPS]  85.09,22.86 270 top
XB1  BATTERY_HOLDER_KEYSTONE_498  [498]  33.53,17.27 180 top
XF2  FUSE_HOLDER_MINIBLADESMD  [3588]  30.23,91.95 270 top

## Tracks (layer width: path | path; a pad name or v marks a point on that pad's centre or on a via)
3.3V  (5 unrouted)
24V_SENSE
  Top 0.254: R42.1 R43.2 21.42,18.95 D28.3 17.78,18.8 14.8,21.77 U32.4
!AD1_CS  (via drill 0.35)
  Top 0.254: U23.1 13.72,108.21 13.72,111.76 15.49,113.54 23.62,113.54 v27.69,109.47 | v27.69,106.43 35.81,106.43 v36.32,105.92 | v75.44,98.81 76.2,98.04 77.47,98.04 78.74,96.77 A2.D41
  Bottom 0.254: v27.69,109.47 v27.69,106.43 | v36.32,105.92 37.08,105.92 40.89,102.11 72.14,102.11 v75.44,98.81
!AD2_CS  (via drill 0.35)
  Top 0.254: U7.1 13.73,90.7 24.38,101.35 v38.86,101.35
  Bottom 0.254: v38.86,101.35 71.63,101.35 76.2,96.77 A2.D40
!AD3_CS  (via drill 0.35)
  Top 0.254: U6.1 13.73,53.36 16.26,55.88 v23.11,55.88 | v34.54,93.22 40.13,98.81 v40.13,100.58
  Bottom 0.254: v34.54,93.22 34.54,67.31 v23.11,55.88 | v40.13,100.58 70.87,100.58 73.66,97.79 A2.D39
!AD4_CS  (via drill 0.35)
  Top 0.254: U32.1 17.51,23.35 20.32,26.16 39.12,26.16 v41.4,28.45
  Bottom 0.254: v41.4,28.45 52.07,39.12 56.9,39.12 A3.D33
!IMU_CS
  Top 0.254: J2.6 118.09,127.27 118.87,126.49 118.87,117.6 117.6,116.33 111.25,116.33 A2.D3
!IMU_RESET
  Top 0.254: J2.8 118.36,128.27 119.63,127 119.63,117.09 117.86,115.32 112.78,115.32 A2.D2
+3V3  (via drill 0.35)
  Top 0.254: U23.13 21.28,106.24 C54.1 C56.1 21.35,102.6 v22.86,101.09 | C21.1 C19.1 21.28,60.78 U7.13 18.47,60.78 v17.78,61.47 | C17.1 44.84,112.39 45.72,112.39 | 45.72,112.39 U4.5 | v111.25,130.3 111.51,130.3 111.54,130.27 J2.11 | C82.1 C80.1 14.8,16.09 U32.13 14.8,18.98 v14.73,19.05 | 53.59,106.05 U3.5 56.45,107.95 77.72,107.95 80.01,110.24 80.01,113.03 93.22,126.24 93.22,129.03 95,130.81 97.79,130.81 99.31,129.29 v106.43,129.29 | 53.59,106.05 52.69,106.05 C15.1 | U6.13 20.57,48.08 | 20.57,48.08 21.28,48.08 C18.1 C24.1 | v20.57,46.99 20.57,48.08 | U33.5 44.84,45.34 C85.1 41.39,45.48 v41.15,45.72 | U1.4 29.31,63.35 v28.7,62.74 27.69,61.72 27.69,50.29 v25.91,48.51 | C4.1 39.85,56.65 v41.15,56.65 C104.1 44.84,56.52 U46.5 47.37,56.52 49.53,54.36 49.53,53.33 C102.1 52.69,50.16 U45.5 56.2,51.82 66.8,51.82 67.06,52.07 72.64,52.07 74.68,50.04 95.76,50.04 v100.33,54.61 | v40.13,84.58 40.13,75.44 TP3.1 36.83,72.14 U1.2 36.83,71.63 24.13,84.33 v24.13,99.82 | v40.13,89.15 40.13,93.47 41.91,95.25 47.24,95.25 48.77,96.77 48.77,100.58 48.13,101.22 U2.5 44.84,101.22 C13.1 41.91,104.15 v41.91,105.16 | v53.59,107.19 53.59,106.05 | v45.47,111.51 45.72,111.76 45.72,112.39 | R12.1 117.69,37.34 v107.7,37.34
  Top 0.813: U1.4 36.83,61.73 C4.1
  Top 1.016: U1.2 U1.4
  Route2 0.254: v28.7,62.74 19.05,62.74 v17.78,61.47 | v20.57,46.99 22.1,48.51 v25.91,48.51 | v41.15,56.65 v41.15,45.72 41.15,39.37 v47.75,32.77
  Route15 0.254: v40.13,84.58 v40.13,89.15
  Bottom 0.254: C28.1 109.97,129.29 | 109.97,129.29 C29.1 | C27.1 C28.1 | A4.1 53.34,14.22 | 53.34,14.22 53.35,14.24 | 53.35,14.24 C77.1 | C76.1 53.33,14.24 53.34,14.22 | C28.1 v111.25,130.3 | v25.91,48.51 25.15,47.75 25.15,34.54 14.73,24.13 v14.73,19.05 | 53.35,14.24 53.35,27.17 v47.75,32.77 | v22.86,101.09 v24.13,99.82 | v53.59,107.19 51.56,105.16 v41.91,105.16 41.91,107.95 v45.47,111.51 | v106.43,129.29 109.97,129.29 | U5.5 103.38,68.35 103.38,61.21 100.33,58.17 v100.33,54.61 100.33,46.99 105.41,41.91 105.41,39.62 v107.7,37.34
+5V  (via drill 0.35)
  Top 0.254: U23.2 14.58,107.54 15.49,108.46 C57.1 C55.1 18.03,109.49 v18.03,108.71 | U7.2 14.58,62.08 15.49,62.99 15.49,63.25 | 15.49,63.25 C22.1 C20.1 | C16.1 54.24,111.12 U4.3 50.93,111.12 v50.8,111.25 | U3.3 61.86,104.78 C14.1 63.74,104.89 v64.01,105.16 | U2.3 54.24,99.95 C12.1 56.15,100.06 v56.39,99.82 | C103.1 54.24,55.24 U46.3 50.93,55.24 v50.8,55.12 | U45.3 61.86,48.9 C100.1 64,49.01 v64.01,49.02 | U34.5 16.34,41.81 C92.1 v17.27,42.16 | C95.1 17.41,29.06 U39.5 17.84,30.23 v18.54,30.23 | C83.1 C81.1 16.1,25.31 U32.2 16.1,22 v16.26,21.84 | v16.51,63.25 15.49,63.25 | C23.1 16.76,52.07 | 16.76,52.07 15.74,52.07 C25.1 15.49,50.29 14.58,49.38 U6.2 | v16.76,53.34 16.76,52.07 | v13.46,29.72 14.48,30.73 R62.2 | v21.34,42.16 C93.1 20.4,41.81 U37.5 19.56,39.68 19.56,38.19 R60.2 | U38.5 24.38,40.61 v24.38,41.66 | v26.67,34.04 26.67,33.33 U44.5 | U33.3 53.59,44.07 | 53.59,44.07 54.24,44.07 C84.1 | v53.59,45.21 53.59,44.07 | A1.3 TP2.1 | C11.1 116.84,43.18 | 116.84,43.18 C9.1 | 116.84,43.18 A3.VIN 119.29,38.19 R13.1 | C10.1 116.84,99.06 | 116.84,99.06 C8.1 | A2.VIN 116.84,99.06 | R23.2 66.8,136.82 v66.8,136.91 | U42.5 25.91,45.95 v25.91,46.74
  Top 0.305: C99.1 23.45,79.41 23.45,78.99 | 23.45,78.99 U41.5 | v24.38,78.99 23.45,78.99 | U43.5 23.45,74.42 | 23.45,74.42 23.45,74.83 C101.1 | v24.38,74.42 23.45,74.42 | R68.2 v24.38,70.61
  Top 0.813: A1.3 C2.1 | U1.3 32.17,69.75 C3.1 32.26,69.84 v32.26,70.87
  Top 1.27: J1.14 43.83,139.84 40.89,136.91 A1.3
  Bottom 0.254: C78.1 87.64,15.24 | 87.64,15.24 C79.1 | XA1.VIN 87.64,15.24 | R14.2 88.14,31.58 v88.14,31.75
  pour Route2: -0.51,152.91 -0.51,-0.51 127.51,-0.51 127.51,152.91
+24V  (via drill 0.35)
  Top 0.254: D37.3 35.14,29.72 Q3.2 37.08,29.78 37.08,31.24 35.81,32.51 35.31,32.51 | 35.31,32.51 R64.2 | R42.2 21.5,25.15 35.05,25.15 v35.31,25.4 | v35.31,34.04 35.31,32.51 | v23.11,86.87 23.11,83.82 33.53,73.41 v33.53,71.88 | v82.55,73.91 v77.47,73.91 | v90.17,73.91 v84.84,73.91 | TP1.1 28.7,134.62 31.59,134.62
  Top 0.813: C1.1 31.59,134.62 A1.1
  Top 1.27: XF2.2 v29.97,96.9 XF2.1 | J1.15 J1.16 41.83,140.64 A1.1 35.81,129.07 C26.PLUS 26.67,119.93 v26.67,113.79
  Route2 0.254: v33.53,64.52 v33.53,71.88 33.53,73.41 36.83,76.71 v44.2,76.71 | 30.15,97.08 23.11,90.04 v23.11,86.87
  Route2 1.27: v26.67,113.79 30.15,110.31 30.15,97.08 v29.97,96.9
  Bottom 0.254: v35.31,25.4 v35.31,34.04 32.51,34.04 28.19,38.35 28.19,59.18 v33.53,64.52 | D36.3 92.81,74.26 R9.2 | Q5.2 92.46,69.15 D36.3 | v44.2,76.71 46.99,73.91 v77.47,73.91 | v84.84,73.91 v82.55,73.91 | D36.3 90.18,73.9 v90.17,73.91
ACCEL_1
  Top 0.254: U7.6 11.39,59.48 9.4,61.47 9.4,62.74 8.62,63.51 6.37,63.51 J5.5
ACCEL_1_EXT
  Bottom 0.254: J5.3 6.35,67.53 6.35,69.6 14.73,77.98 14.73,104.65 15.75,105.66 15.75,107.19 14.73,108.2 14.73,132.08 26.85,144.19 26.85,146.07 J1.29
ACCEL_2
  Top 0.254: J5.9 6.33,59.55 10.05,59.55 10.77,58.83 U7.7
ACCEL_2_EXT
  Bottom 0.254: J5.7 6.35,63.53 6.35,65.02 6.86,65.53 7.87,65.53 8.64,66.29 8.64,70.87 15.49,77.72 15.49,104.39 16.51,105.41 16.51,107.44 15.49,108.46 15.49,131.83 27.83,144.16 J1.30
BMS_OK  (via drill 0.35)
  Top 0.254: K10.A1 61.02,62.29 D6.C | J3.24 87.17,134.41 69.09,116.33 v58.93,116.33 v48.01,116.33 | R30.1 v58.93,135.89
  Bottom 0.254: K10.A1 54.18,70.87 47.5,70.87 42.16,76.2 42.16,95.5 34.54,103.12 34.54,113.28 37.59,116.33 v48.01,116.33 | v58.93,135.89 v58.93,116.33
BOTS_SENSE  (via drill 0.35)
  Top 0.254: A2.D29 68.58,114.3 70.1,114.3 v87.88,132.08
  Bottom 0.254: R20.2 R19.1 87.97,132.17 v87.88,132.08
BOTS_SENSE_EXT  (via drill 0.35)
  Top 0.254: K1.A1 107.25,62.29 | 107.25,62.29 D45.C | J3.21 88.15,146.03 88.15,133.87 69.6,115.32 v48.77,115.32 | v72.39,64.01 78.23,58.17 103.12,58.17 107.25,62.29
  Bottom 0.254: v72.39,64.01 64.52,71.88 47.75,71.88 43.18,76.45 43.18,95.76 35.56,103.38 35.56,112.78 38.1,115.32 v48.77,115.32 | J3.21 88.15,146.03 88.15,143.41 D43.A
BRAKE_1
  Top 0.254: J5.13 6.33,57.51 10.02,57.51 10.68,58.18 U7.8 14.23,58.18 16.51,60.45 16.51,61.47 19.3,64.26 19.3,73.41 | U41.1 20.46,78.12 19.3,76.96 19.3,73.41 | U43.1 19.45,73.55 19.3,73.41
BRAKE_1_EXT
  Bottom 0.254: J5.11 6.35,59.53 6.35,60.96 6.9,61.51 8.17,61.51 9.4,62.74 9.4,70.61 16.26,77.47 16.26,104.14 17.27,105.16 17.27,132.59 28.81,144.13 28.81,146.03 J1.27
BRAKE_2
  Top 0.254: U7.11 16.55,59.48 14.48,57.4 11.18,57.4 9.4,55.63 9.4,54.36 8.59,53.55 6.37,53.55 J5.17
BRAKE_2_EXT
  Bottom 0.254: J5.15 6.33,55.51 8.27,55.51 10.16,57.4 10.16,70.36 17.02,77.22 17.02,103.38 18.8,105.16 18.8,133.1 29.83,144.13 J1.28
BRAKE_HIGH  (via drill 0.35)
  Top 0.254: U41.4 25.29,76.82 29.97,72.14 29.97,66.04 26.92,62.99 v26.92,53.34 24.89,51.31 24.89,44.76 U42.1 | v118.36,19.81 118.45,19.9 R40.1
  Bottom 0.254: v118.36,19.81 106.68,19.81 95.5,8.64 50.04,8.64 27.69,30.99 27.69,34.54 26.92,35.31 v26.92,53.34
BRAKE_MISSING  (via drill 0.35)
  Top 0.254: U43.4 25.65,72.25 | 25.65,72.25 26.81,72.25 29.21,69.85 29.21,66.29 26.16,63.25 26.16,53.59 24.13,51.56 24.13,45.47 22.27,43.6 U38.1 | 25.65,72.25 v25.65,74.42 | v25.65,78.99 25.65,79.5 23.37,81.79 18.03,81.79 TP6.1
  Bottom 0.254: v25.65,74.42 v25.65,78.99
BRAKE_PRESSURE_F
  Top 0.254: U6.4 12.01,48.08 8.89,44.96 8.89,44.07 J5.28
BRAKE_PRESSURE_F_EXT
  Bottom 0.254: J5.27 6.33,43.51 8.46,43.51 19.3,54.36 19.3,102.62 21.08,104.39 21.08,132.33 32.81,144.06 32.81,146.03 J1.23
BRAKE_PRESSURE_R
  Top 0.254: U6.5 12.38,47.43 9.65,44.7 9.65,42.83 J5.30
BRAKE_PRESSURE_R_EXT
  Bottom 0.254: J5.29 6.33,41.51 8.49,41.51 10.41,43.43 10.41,44.45 20.07,54.1 20.07,102.36 21.84,104.14 21.84,132.08 33.83,144.07 J1.24
BRAKELIGHT_EN  (via drill 0.35)
  Top 0.254: J3.9 100.19,146.07 100.19,137.05 104.65,132.59 v104.65,130.05 | v104.65,125.48 104.65,122.94 99.06,117.35 A2.D6
  Bottom 0.254: v104.65,130.05 v104.65,125.48
BSPD_FAULT
  Top 0.254: U42.4 27.26,40.22 25.15,38.1 25.15,32.51 24.89,32.26 U44.2
BSPD_OK  (via drill 0.35)
  Top 0.254: D24.C 76.26,62.29 K11.A1 | Q3.3 v40.13,29.72 | R31.1 93.31,23.71 88.65,19.05 79.25,19.05 75.44,15.24 v44.96,15.24
  Bottom 0.254: K11.A1 76.26,62.04 74.93,60.71 68.33,60.71 64.77,57.15 64.77,53.09 41.4,29.72 v40.13,29.72 40.13,20.07 v44.96,15.24
BSPD_OK_LV
  Top 0.254: R65.2 26.25,30.22 U44.4 27.1,31.61 | 27.1,31.61 Q4.1 | 27.1,31.61 28.07,31.61 D38.3
CAN_ECU_RX1
  Top 0.254: U2.4 50.93,101.22 49.78,100.08 49.78,97.79 51.05,96.52 55.37,96.52 59.18,100.33 62.74,100.33 64.77,102.36 100.84,102.36 A2.D22
CAN_ECU_RX2
  Top 0.254: U3.4 66.67,106.05 68.83,103.89 106.43,103.89 A2.D0
CAN_ECU_RX3
  Top 0.254: U4.4 53.53,113.79 61.47,113.79 A2.D30
CAN_ECU_TX1
  Top 0.254: U2.1 55.24,97.41 58.93,101.09 62.48,101.09 64.52,103.12 102.62,103.12 A2.D23
CAN_ECU_TX2
  Top 0.254: U3.1 58.8,102.23 58.17,102.87 58.17,106.17 58.93,106.93 66.8,106.93 69.09,104.65 104.65,104.65 A2.D1
CAN_ECU_TX3
  Top 0.254: U4.1 57.78,108.58 A2.D31
CAN_TCU_RX1
  Top 0.254: U33.4 51.18,45.34 49.78,43.94 49.78,41.91 51.05,40.64 55.12,40.64 58.93,44.45 63.75,44.45 65.79,46.48 100.84,46.48 A3.D22
CAN_TCU_RX2
  Top 0.254: U45.4 66.67,50.16 68.83,48.01 106.43,48.01 A3.D0
CAN_TCU_RX3
  Top 0.254: U46.4 53.53,57.91 61.47,57.91 A3.D30
CAN_TCU_TX1
  Top 0.254: U33.1 54.99,41.53 58.67,45.21 63.5,45.21 65.53,47.24 102.62,47.24 A3.D23
CAN_TCU_TX2
  Top 0.254: U45.1 58.8,46.35 58.17,46.99 58.17,50.29 58.93,51.05 66.8,51.05 69.09,48.77 104.65,48.77 A3.D1
CAN_TCU_TX3
  Top 0.254: U46.1 57.78,52.7 A3.D31
CANH_1  (via drill 0.35)
  Top 0.254: U2.7 46.55,99.06 43.18,99.06 38.1,104.14 38.1,118.62 46.48,127 46.48,138.18 45.97,138.68 45.97,140.72 46.48,141.22 46.48,144.46 45.89,145.05 J1.12 | U33.7 46.55,43.18 45.72,43.18 v45.21,42.67 44.7,43.18 42.42,43.18 40.39,41.15 34.8,41.15 JP1.2
  Bottom 0.254: v45.21,42.67 44.7,43.18 40.39,43.18 35.56,48.01 35.56,93.47 28.45,100.58 28.45,117.86 46.48,135.89 46.48,138.2 D1.2 45.97,138.71 45.97,144.91 J1.12
CANH_2  (via drill 0.35)
  Top 0.254: U3.7 54.17,103.89 44.45,103.89 40.13,108.2 40.13,116.84 50.55,127.25 50.55,138.18 50.04,138.68 50.04,140.72 50.55,141.22 50.55,144.4 49.89,145.05 J1.8 | U45.7 54.17,48.01 53.34,48.01 v52.83,47.5 52.32,48.01 34.8,48.01 JP2.2
  Bottom 0.254: v52.83,47.5 52.32,48.01 40.39,48.01 37.08,51.31 37.08,94.23 29.97,101.35 29.97,116.08 50.55,136.65 50.55,138.2 D2.2 50.04,138.71 50.04,144.84 J1.8
CANH_3  (via drill 0.35)
  Top 0.254: U4.7 46.55,110.24 43.18,110.24 42.16,111.25 42.16,115.32 54.61,127.76 54.61,138.18 54.1,138.68 54.1,140.72 54.61,141.22 54.61,144.33 53.89,145.05 J1.4 | U46.7 46.55,54.36 45.72,54.36 v45.21,53.85 44.7,54.36 34.29,54.36 JP3.2
  Bottom 0.254: v45.21,53.85 44.7,54.36 40.39,54.36 38.61,56.13 38.61,95 31.5,102.11 31.5,114.3 54.61,137.41 54.61,138.2 D3.2 54.1,138.71 54.1,144.78 J1.4
CANL_1  (via drill 0.35)
  Top 0.254: U2.6 46.55,99.57 43.43,99.57 38.61,104.39 38.61,118.36 46.99,126.75 46.99,138.18 47.5,138.68 47.5,140.72 46.99,141.22 46.99,144.21 J1.10 | U33.6 46.55,43.69 45.72,43.69 v45.21,44.2 44.7,43.69 42.16,43.69 40.13,41.66 35.39,41.66 R5.1
  Bottom 0.254: v45.21,44.2 44.7,43.69 40.64,43.69 36.07,48.26 36.07,93.73 28.96,100.84 28.96,117.6 46.99,135.64 46.99,138.2 D1.1 47.5,138.71 47.5,144.72 J1.10
CANL_2  (via drill 0.35)
  Top 0.254: U3.6 54.17,104.39 44.7,104.39 40.64,108.46 40.64,116.59 51.05,127 51.05,138.18 51.56,138.68 51.56,140.72 51.05,141.22 51.05,144.27 J1.6 | U45.6 54.17,48.51 53.34,48.51 v52.83,49.02 52.32,48.51 35.39,48.51 R1.1
  Bottom 0.254: v52.83,49.02 52.32,48.51 40.64,48.51 37.59,51.56 37.59,94.49 30.48,101.6 30.48,115.82 51.05,136.4 51.05,138.2 D2.1 51.56,138.71 51.56,144.78 J1.6
CANL_3  (via drill 0.35)
  Top 0.254: U4.6 46.55,110.74 43.43,110.74 42.67,111.51 42.67,115.06 55.12,127.51 55.12,138.18 55.63,138.68 55.63,140.72 55.12,141.22 55.12,144.34 J1.2 | U46.6 46.55,54.86 45.72,54.86 v45.21,55.37 44.7,54.86 35.9,54.86 R3.1
  Bottom 0.254: v45.21,55.37 44.7,54.86 40.64,54.86 39.12,56.39 39.12,95.25 32,102.36 32,114.05 55.12,137.16 55.12,138.2 D3.1 55.57,138.67 55.57,144.79 J1.2
CURRENT
  Top 0.254: J5.34 10.41,39.59 10.41,44.45 12.74,46.78 U6.6 14.44,46.78 14.99,46.23 14.99,45.21 13.46,43.69 13.46,41.21 U34.1 14.84,40.53 15.24,40.13 15.24,37.08 15.75,36.58 16.76,36.58 17.41,35.93 17.41,33.78 | 17.41,33.78 U39.1 | U32.5 14.15,27 10.92,30.23 10.92,33.27 11.43,33.78 17.41,33.78
CURRENT_EXT
  Bottom 0.254: J5.32 8.62,38.53 11.68,41.59 11.68,44.2 21.34,53.85 21.34,101.85 23.62,104.14 23.62,130.81 36.83,144.02 36.83,146.05 J1.19
CURRENT_HIGH  (via drill 0.35)
  Top 0.254: U42.2 24.13,43.94 v23.37,43.18 | v21.34,38.1 20.4,39.03 U37.4 | TP5.1 8.89,22.1 v12.45,25.65
  Bottom 0.254: v23.37,43.18 23.37,40.13 v21.34,38.1 20.07,38.1 12.45,30.48 v12.45,25.65
CURRENT_MISSING
  Top 0.254: U39.4 16.11,31.35 16.26,31.5 19.05,31.5 19.94,32.38 | 19.94,32.38 23.37,35.81 23.37,39.62 23.11,39.88 U38.2 | TP4.1 19.94,32.38
ECU_CLK  (via drill 0.35)
  Top 0.254: U23.16 19.55,108.19 21.34,109.98 v25.4,109.98 | U6.16 23.88,54.62 23.88,64.01 25.91,66.04 v25.91,66.8 | v25.91,69.34 25.15,69.34 21.59,65.79 21.59,64.52 19.8,62.73 U7.16 | v76.71,99.31 76.96,99.06 81.28,99.06 A2.D13 | v25.4,107.19 36.83,107.19 v37.08,106.93 | J2.3 100.87,126.27 87.63,113.03 87.63,111 83.82,107.19 v83.82,105.66
  Bottom 0.254: v25.91,66.8 v25.91,69.34 25.91,70.36 28.96,73.41 30.99,73.41 32.26,74.68 32.26,87.63 25.4,94.49 v25.4,107.19 v25.4,109.98 | v37.08,106.93 41.15,102.87 73.15,102.87 v76.71,99.31 | v83.82,105.66 A2.D13
ECU_SDI  (via drill 0.35)
  Top 0.254: U23.15 19.91,107.54 21.34,108.97 v26.16,108.97 26.42,108.71 35.56,108.71 35.81,108.97 v37.08,108.97 | U6.15 19.91,49.38 24.64,54.1 24.64,63.75 27.18,66.29 v27.18,66.8 | v27.18,69.34 27.18,68.83 26.67,68.33 25.15,68.33 22.35,65.53 22.35,64.26 20.17,62.08 U7.15 | v74.42,106.43 74.68,106.68 78.74,106.68 A2.D12 100.33,128.27 106.68,128.27 111.25,132.84 116.84,132.84 v117.35,132.33 | J2.4 117.32,126.27 v117.35,126.24
  Bottom 0.254: v27.18,66.8 v27.18,69.34 27.18,70.36 29.46,72.64 31.24,72.64 33.02,74.42 33.02,87.88 26.16,94.74 v26.16,108.97 | v37.08,108.97 41.66,104.39 72.39,104.39 v74.42,106.43 | v117.35,126.24 v117.35,132.33
ECU_SDO  (via drill 0.35)
  Top 0.254: U23.14 20.28,106.89 21.34,107.95 v26.92,107.95 v36.32,107.95 | U6.14 20.28,48.73 25.4,53.85 25.4,63.5 28.45,66.55 28.45,67.56 | 28.45,67.56 v28.45,69.34 | 28.45,67.56 25.4,67.56 23.11,65.28 23.11,64.01 20.53,61.43 U7.14 | v75.44,105.66 80.26,105.66 A2.D11 86.36,113.03 100.6,127.27 J2.5
  Bottom 0.254: v28.45,69.34 28.45,70.36 29.97,71.88 31.5,71.88 33.78,74.17 33.78,88.14 26.92,95 v26.92,107.95 | v36.32,107.95 37.08,107.95 41.4,103.63 73.15,103.63 75.18,105.66 v75.44,105.66
FL_INTERLOCK_SENSE  (via drill 0.35)
  Top 0.254: v88.65,126.75 76.2,114.3 A2.D25
  Bottom 0.254: R45.2 R44.1 100.08,137.25 100.08,133.03 97.85,130.81 95.25,130.81 93.73,129.29 91.19,129.29 v88.65,126.75
FL_INTERLOCK_SENSE_EXT
  Bottom 0.254: J3.17 92.19,146.07 92.19,143.02 93.47,141.73 95,141.73 96.27,140.46 D29.A
FR_INTERLOCK_SENSE  (via drill 0.35)
  Top 0.254: v88.65,125.22 78.74,115.32 A2.D24
  Bottom 0.254: R11.2 R10.1 104.74,132.93 103.76,131.95 101.73,131.95 100.33,130.56 100.33,129.03 96.52,125.22 v88.65,125.22
FR_INTERLOCK_SENSE_EXT
  Bottom 0.254: J3.18 93.17,143.05 93.73,142.49 95.5,142.49 96.9,141.1 100.71,141.1 101.35,140.46 D40.A
GND  (via drill 0.35)
  Top 0.254: v18.03,105.66 18.11,105.59 U23.12 | U23.3 14.52,106.89 v14.99,106.43 | v18.03,60.2 18.11,60.13 U7.12 | U7.3 15.03,61.43 v15.24,61.21 | U6.3 12.49,48.73 v12.19,49.02 | U6.12 18.36,47.43 v17.78,48.01
  other vias: 16.51,112.52 24.38,102.36 16.51,67.06 23.37,49.78 111.25,131.57 17.53,54.36 23.11,57.15 28.7,17.27 13.46,19.3 14.73,27.69 15.49,31.75 19.3,40.89 20.07,34.54 46.74,139.67 50.8,139.67 54.86,139.67 90.17,15.24 12.7,39.37 65.28,105.16 57.15,105.41 49.78,105.92 50.8,109.98 96.77,75.18 104.39,71.37 97.79,68.07 54.36,18.54 52.32,18.54 11.94,14.73 18.8,26.92 18.54,22.61 24.64,27.94 28.96,27.43 30.99,33.53 32.77,51.31 29.97,59.44 32.77,44.45 30.73,37.59 35.56,36.32 50.8,98.81 50.8,42.67 61.72,46.23 50.8,53.85 25.91,41.91 24.38,75.69 56.9,109.47
  pour Route15: 0,152.4 0,0 127,0 127,152.4
  pour Bottom: -0.51,152.91 -0.51,-0.51 127.51,-0.51 127.51,152.91
  pour Top: -0.51,152.91 -0.51,-0.51 127.51,-0.51 127.51,152.91
GPS_FIX
  Bottom 0.254: XA1.FIX 78.74,31.75 A3.D41
GPS_RX
  Bottom 0.254: XA1.RX 90.17,25.4 90.17,41.4 89.41,42.16 87.12,42.16 86.36,41.4 A3.D14
GPS_TX
  Top 0.254: XA1.TX 88.9,26.67 A3.D15
IMU_DATAREADY
  Top 0.254: J2.1 112.7,122.86 A2.D5
IMU_SYNC
  Top 0.254: J2.2 117.55,125.27 118.11,124.71 118.11,118.11 117.35,117.35 109.73,117.35 A2.D4
INERTIA_SENSE  (via drill 0.35)
  Top 0.254: v88.65,131.06 88.39,131.06 70.61,113.28 70.1,113.28 A2.D28
  Bottom 0.254: R22.2 R21.1 93.05,132.42 92.2,131.57 89.15,131.57 v88.65,131.06
INERTIA_SENSE_EXT
  Bottom 0.254: J3.22 89.17,135.75 D44.A
INVERTER_24V_EN  (via drill 0.35)
  Top 0.254: J3.12 99.17,137.05 103.89,132.33 v103.89,131.06 | v103.89,124.46 103.89,123.44 96.52,116.08 A2.D7
  Bottom 0.254: v103.89,131.06 v103.89,124.46
INVERTER_CTL_EN  (via drill 0.35)
  Top 0.254: J3.13 96.19,146.07 96.19,136.48 101.6,131.06 v101.6,130.05 | v101.6,125.48 101.6,124.97 88.9,112.27 A2.D10
  Bottom 0.254: v101.6,130.05 v101.6,125.48
INVERTER_OUTPUT_STAGE_EN  (via drill 0.35)
  Top 0.254: J3.14 97.17,136.76 102.36,131.57 v102.36,131.06 | v102.36,124.46 91.44,113.54 A2.D9
  Bottom 0.254: v102.36,131.06 v102.36,124.46
INVERTER_TORQUE_LIMIT_EN  (via drill 0.35)
  Top 0.254: J3.11 98.19,146.07 98.19,137.02 103.12,132.08 v103.12,130.05 | v103.12,125.48 103.12,123.95 93.98,114.81 A2.D8
  Bottom 0.254: v103.12,130.05 v103.12,125.48
LATCH_BTN  (via drill 0.35)
  Top 0.254: LATCH.1 69.03,139.19 73.17,139.19
  Top 0.508: v84.33,134.62 75.18,134.62 73.17,136.63 73.17,139.19 J3.38 | J3.38 J3.37 J3.39 J3.40 J3.38
  Bottom 0.508: D46.C D35.C D25.C D7.C D5.C 97.79,107.07 97.79,113.28 84.33,126.75 v84.33,134.62
LOAD_FL
  Top 0.254: J4.5 6.33,116.89 8.34,116.89 10.67,114.55 10.67,108.46 12.88,106.24 U23.4
LOAD_FL_EXT
  Bottom 0.254: J1.39 16.76,145.98 16.76,144.27 7.11,134.62 7.11,125.73 4.06,122.68 4.06,121.16 J4.3
LOAD_FR
  Top 0.254: J4.9 6.33,112.89 8.27,112.89 9.65,111.51 9.65,108.46 12.52,105.59 U23.5
LOAD_FR_EXT
  Bottom 0.254: J4.7 6.35,116.87 6.35,123.19 7.87,124.71 7.87,134.33 17.83,144.29 J1.40
LOAD_RL
  Top 0.254: J4.13 6.37,108.85 8.24,108.85 12.15,104.94 U23.6
LOAD_RL_EXT
  Bottom 0.254: J4.11 6.35,112.87 6.35,114.3 6.9,114.85 7.92,114.85 8.64,115.57 8.64,134.11 18.81,144.29 18.81,146.03 J1.37
LOAD_RR
  Top 0.254: J4.17 6.33,104.89 8.14,104.89 8.74,104.29 U23.7
LOAD_RR_EXT
  Bottom 0.254: J4.15 6.35,108.87 6.35,110.26 6.94,110.85 7.72,110.85 9.4,112.53 9.4,133.86 19.83,144.29 J1.38
N$1
  Top 0.254: R6.2 29.88,40.98 JP1.1
N$2
  Top 0.254: R2.2 29.88,47.84 JP2.1
N$3
  Bottom 0.254: D40.C 101.48,133.1 R10.2
N$4
  Bottom 0.254: Q5.1 93.46,70.87 | 93.46,70.87 93.46,71.83 D36.1 | 93.46,70.87 93.55,70.95 R8.2 R9.1
N$5
  Bottom 0.254: Q6.3 95.42,69.09 R8.1
N$6
  Top 0.254: R4.2 29.88,54.7 JP3.1
N$7
  Top 0.254: R1.2 R2.1 31.48,49.38 C5.1
N$8
  Top 0.254: R3.2 R4.1 31.48,56.23 C6.1
N$9
  Top 0.254: R5.2 R6.1 31.48,42.52 C7.1
N$10
  Bottom 0.254: D41.C 90.56,137.67 R15.2
N$11
  Bottom 0.254: D42.C 95.64,133.1 R17.2
N$12
  Bottom 0.254: D43.C 84.72,137.67 R19.2
N$13
  Top 0.254: R38.2 122.66,85 F.2
N$14
  Bottom 0.254: D44.C 89.8,133.1 R21.2
N$15
  Top 0.254: LATCH.2 69.43,137.9 R23.1
N$16
  Top 0.254: R24.2 122.66,65.95 A.2
N$17
  Top 0.254: R25.2 122.66,69.76 B.2
N$18
  Top 0.254: R26.2 122.66,73.57 C.2
N$19
  Top 0.254: R27.2 122.66,77.38 D.2
N$20
  Top 0.254: R28.2 122.66,81.19 E.2
N$21  (via drill 0.35)
  Top 0.254: K9.11 53.28,76.83 K9.A2 53.28,62.29 D4.A | v97.79,101.6 68.58,101.6 65.79,98.81 60.96,98.81 59.69,97.54 59.69,95.5 v55.88,91.69
  Bottom 0.254: D5.A 99.31,103.12 v97.79,101.6 | v55.88,91.69 53.15,91.69 K9.11
N$22  (via drill 0.35)
  Top 0.254: K11.11 83.76,76.83 K11.A2 83.76,62.29 D24.A | v99.82,100.08 74.68,100.08 v72.39,97.79
  Bottom 0.254: D25.A 100.72,100.08 v99.82,100.08 | K11.11 72.39,88.2 v72.39,97.79
N$23  (via drill 0.35)
  Top 0.254: K10.11 68.52,76.83 K10.A2 68.52,62.29 D6.A | v98.81,100.84 72.9,100.84 v69.85,97.79
  Bottom 0.254: D7.A 99.19,100.84 v98.81,100.84 | v69.85,97.79 69.85,93.16 K10.11
N$24
  Top 0.254: K1.11 114.75,77.08 K1.A2 114.75,62.29 D45.A
  Bottom 0.254: D46.A 110.49,101.21 110.49,87.82 K1.11
N$25
  Top 0.254: K12.11 92.01,84.33 98.75,77.59 98.75,65.04 K12.A2 99.51,62.29 D34.A
  Bottom 0.254: D35.A 100.33,97.4 100.33,92.9 K12.11
N$40
  Top 0.254: IMD.2 65.59,135.91 R29.2
N$41
  Top 0.254: BMS.2 61.78,135.91 R30.2
N$42
  Top 0.254: R31.2 122.66,22.01 BSPD.2
N$43
  Top 0.254: R32.2 122.66,58.33 WDOG.2
N$44
  Top 0.254: R12.2 122.66,32.68 3V3.2
N$45
  Top 0.254: R34.2 120.67,62.17 SWOK.2
N$47
  Top 0.254: R13.2 122.66,36.49 5V0.2
N$48
  Top 0.254: D21.1 R35.2
N$49  (via drill 0.35)
  Top 0.254: D21.2 43.94,34.04 46.23,31.75 v46.23,28.7
  Bottom 0.254: v46.23,28.7 46.23,13.72 50.55,9.4 60.88,9.4 A4.6
N$50
  Top 0.254: D22.2 48.59,38.61 A4.20
N$51
  Top 0.254: D23.2 46.48,36.32 51.56,31.24 60.72,31.24 A4.15
N$52
  Bottom 0.254: R14.1 XA1.EN
N$53
  Top 0.254: D22.1 R37.2
N$54
  Top 0.254: D23.1 R36.2
N$56
  Top 0.254: R40.2 122.66,18.2 BRAKE.2
N$58
  Bottom 0.254: D29.C 96.4,137.67 R44.2
N$59
  Top 0.254: D30.C R46.2
N$60
  Top 0.254: D31.C R48.2
N$61
  Top 0.254: D32.C R50.2
N$62
  Top 0.254: D33.C R52.2
N$65
  Top 0.254: U37.3 18.2,37.84 R60.1 R61.2
N$67
  Top 0.254: U34.3 14.14,37.84 R59.1 R58.2
N$68
  Top 0.254: R59.2 16.34,37.84 U34.4 17.64,40.53 U37.1
N$72
  Top 0.254: R63.2 R62.1 14.73,32.85 U39.3
N$73
  Top 0.254: U41.3 21.7,76.82 22.35,77.47 VR1.2
N$74
  Top 0.254: R66.2 R64.1 32.17,30.81 D37.1 Q3.1
N$75
  Top 0.254: Q4.3 30.72,34.53 31.24,35.05 33.11,35.05 R66.1
N$76
  Top 0.254: U43.3 21.25,70.86 R68.1 R69.2
OKHS_IN  (via drill 0.35)
  Top 0.254: K9.A1 45.78,62.29 D4.C | J3.23 86.15,146.03 86.15,134.92 68.58,117.35 64.01,117.35 | v47.24,117.35 62.23,117.35 64.01,117.35 | R29.1 63.92,117.44 64.01,117.35
  Bottom 0.254: K9.A1 41.15,68.66 41.15,95.25 33.53,102.87 33.53,113.54 37.34,117.35 v47.24,117.35
REFERENCE
  Top 0.254: U6.7 13.11,46.13 11.18,44.2 11.18,36.36 | 11.18,36.36 J5.38 13.5,26.38 U32.6 | 11.18,36.36 12.99,34.54 15.07,34.54 R58.1
REFERENCE_EXT
  Bottom 0.254: J1.20 37.83,144 24.38,130.56 24.38,103.89 22.1,101.6 22.1,53.59 12.45,43.94 12.45,40.39 8.87,36.82 8.87,36.05 J5.36
RL_INTERLOCK_SENSE  (via drill 0.35)
  Top 0.254: A2.D27 71.12,112.27 v88.65,129.79
  Bottom 0.254: R16.2 R15.1 94.32,137.16 94.32,132.42 92.71,130.81 89.66,130.81 v88.65,129.79
RL_INTERLOCK_SENSE_EXT
  Bottom 0.254: J3.19 90.17,146.05 90.17,140.09 D41.A
RR_INTERLOCK_SENSE  (via drill 0.35)
  Top 0.254: A2.D26 73.66,113.28 v88.65,128.27
  Bottom 0.254: R18.2 R17.1 97.37,131.57 94.74,131.57 93.22,130.05 90.42,130.05 v88.65,128.27
RR_INTERLOCK_SENSE_EXT
  Bottom 0.254: J3.20 91.17,143.02 93.22,140.97 94.49,140.97 95,140.46 95,135.77 D42.A
SHDN_A  (via drill 0.35)
  Top 0.254: R24.1 119.38,68.92 119.38,71.12 v116.08,74.42 | v105.16,76.2 v100.84,76.2 | v91.19,76.2 85.34,76.2 v84.84,75.69 | v82.55,75.69 v69.6,75.69
  Top 1.27: XF2.3 XF2.4 33.39,86.87 50.74,86.87 K9.21
  Bottom 0.254: v116.08,74.42 114.3,76.2 v105.16,76.2 | v84.84,75.69 v82.55,75.69 | v69.6,75.69 61.92,75.69 K9.21 | v100.84,76.2 v91.19,76.2
SHDN_B  (via drill 0.35)
  Top 0.254: D30.A 53.28,92.9 K9.24 | R25.1 116.17,75.95 v116.08,75.95 | v106.17,76.96 v99.82,76.96 | v90.17,76.96 v84.84,76.96 | v82.55,76.96 75.89,76.96 K10.21
  Top 1.27: K9.24 55.78,86.87 65.98,86.87 K10.21
  Bottom 0.254: v116.08,75.95 115.06,76.96 v106.17,76.96 | v99.82,76.96 v90.17,76.96 | v84.84,76.96 v82.55,76.96
SHDN_B_READ
  Top 0.254: R47.2 R46.1 49.44,94.74 56.64,94.74 A2.D33
SHDN_C  (via drill 0.35)
  Top 0.254: K10.24 68.52,92.9 D31.A | R26.1 120.56,75.27 v118.87,76.96 | v105.16,77.72 v100.84,77.72 | v91.19,77.72 84.58,84.33 K11.21
  Top 1.27: K10.24 71.02,86.87 81.22,86.87 K11.21
  Bottom 0.254: v118.87,76.96 118.11,77.72 v105.16,77.72 | v100.84,77.72 v91.19,77.72
SHDN_C_READ
  Top 0.254: A2.D34 60.96,93.31 R49.2 R48.1
SHDN_D  (via drill 0.35)
  Top 0.254: K11.24 83.76,92.9 D32.A | R27.1 118.71,81.03 v118.62,81.03 | v107.19,82.04 102.05,82.04 K12.21
  Top 1.27: K11.24 86.01,87.12 96.97,87.12 K12.21
  Bottom 0.254: v118.62,81.03 117.6,82.04 v107.19,82.04
SHDN_D_READ
  Top 0.254: R50.1 R51.2 75.27,94.23 65.79,94.23 A2.D35
SHDN_E
  Top 0.254: D33.A 99.53,92.88 99.51,92.86 K12.24 | K1.21 116.44,82.89 R28.1
  Top 1.27: K12.24 102.01,87.12 112.21,87.12 K1.21
SHDN_E_READ
  Top 0.254: R52.1 R53.2 90.26,95 67.56,95 A2.D36
SHDN_F
  Top 0.254: K1.24 117.73,89.62 R38.1
  Bottom 1.27: K1.24 119.63,94.51 119.63,134.59 J3.2 J3.1
SIG_MISSING
  Top 0.254: U44.1 24.47,33.33
  Top 0.305: 24.47,33.33 U38.4
SOFTWARE_OK  (via drill 0.35)
  Top 0.254: R34.1 120.65,64.2 118.36,66.48 118.36,70.61 v116.08,72.9 | v106.17,75.44 v102.36,75.44
  Bottom 0.254: R33.2 100.88,73.2 | 100.88,73.2 101.75,72.32 U5.3 | A2.D20 101.6,75.44 | 101.6,75.44 101.6,73.91 100.88,73.2 | v106.17,75.44 113.54,75.44 v116.08,72.9 | v102.36,75.44 101.6,75.44
SPN_POT_1
  Top 0.254: J4.21 6.35,102.87 8.13,102.87 8.9,103.64 U23.8
SPN_POT_1_EXT
  Bottom 0.254: J4.19 6.35,104.87 6.35,106.43 6.81,106.89 7.83,106.89 10.16,109.22 10.16,133.6 20.83,144.27 20.83,146.05 J1.35
SPN_POT_2
  Top 0.254: U23.11 16.55,104.94 14.48,102.87 12.19,102.87 8.18,98.85 6.33,98.85 J4.25
SPN_POT_2_EXT
  Bottom 0.254: J4.23 6.33,100.85 8.14,100.85 10.92,103.63 10.92,133.35 21.83,144.26 J1.36
SPN_POT_3
  Top 0.254: U23.10 16.92,104.29 14.73,102.11 12.45,102.11 9.65,99.31 9.65,96.27 8.27,94.89 6.37,94.89 J4.29
SPN_POT_3_EXT
  Bottom 0.254: J4.27 6.33,96.85 8.21,96.85 11.68,100.33 11.68,133.1 22.85,144.26 22.85,146.07 J1.33
SPN_POT_4
  Top 0.254: U23.9 17.28,103.64 14.99,101.35 12.7,101.35 10.41,99.06 10.41,92.96 8.34,90.89 6.37,90.89 J4.33
SPN_POT_4_EXT
  Bottom 0.254: J4.31 6.33,92.85 8.27,92.85 12.45,97.03 12.45,132.84 23.83,144.23 J1.34
SPN_POT_5
  Top 0.254: J4.37 6.37,84.85 8.37,84.85 11.43,81.79 11.43,61.98 12.63,60.78 U7.4
SPN_POT_5_EXT
  Bottom 0.254: J4.35 6.33,88.85 8.34,88.85 13.21,93.73 13.21,132.59 24.85,144.23 24.85,146.07 J1.31
SPN_POT_6
  Top 0.254: U7.5 12.01,60.13 10.41,61.72 10.41,65.79 8.65,67.55 6.33,67.55 J5.1
SPN_POT_6_EXT
  Bottom 0.254: J4.39 6.35,84.87 6.35,86.36 6.86,86.87 8.38,86.87 13.97,92.46 13.97,132.33 25.83,144.19 J1.32
STEERING_1
  Top 0.254: U7.10 16.92,58.83 14.73,56.64 11.68,56.64 10.41,55.37 10.41,51.31 8.64,49.53 6.35,49.53 J5.21
STEERING_1_EXT
  Bottom 0.254: J5.19 6.33,51.51 8.33,51.51 10.92,54.1 10.92,70.1 17.78,76.96 17.78,103.12 19.56,104.9 19.56,132.84 30.85,144.13 30.85,146.07 J1.25
STEERING_2
  Top 0.254: U7.9 17.28,58.18 14.99,55.88 12.19,55.88 11.43,55.12 11.43,48.51 8.43,45.51 6.33,45.51 J5.25
STEERING_2_EXT
  Bottom 0.254: J5.23 6.33,47.51 8.4,47.51 11.68,50.8 11.68,69.85 18.54,76.71 18.54,102.87 20.32,104.65 20.32,132.59 31.83,144.1 J1.26
TCU_RX4
  Bottom 0.254: J3.29 81.17,146.44 80.19,145.46 80.19,120.47 87.63,113.03 87.63,94.74 85.85,92.96 85.85,62.99 90.17,58.67 90.17,46.99 91.44,45.72 A3.D16
TCU_RX5
  Bottom 0.254: J3.28 83.17,125.11 95.25,113.03 95.25,96.01 88.9,89.66 88.9,64.26 95.25,57.91 97.03,57.91 97.79,57.15 97.79,46.99 A3.D21
TCU_RX6
  Bottom 0.254: A3.D25 80.52,60.2 80.52,92.2 82.55,94.23 82.55,113.03 78.19,117.39 78.19,146.07 J3.31
TCU_RX7
  Bottom 0.254: A3.D28 70.87,58.17 76.45,58.17 79.5,61.21 79.5,92.71 80.01,93.22 80.01,113.03 77.17,115.87 J3.34
TCU_TX4
  Bottom 0.254: A3.D17 93.98,45.72 92.71,46.99 92.71,57.66 86.87,63.5 86.87,91.95 90.17,95.25 90.17,113.03 81.17,122.03 J3.30
TCU_TX5
  Bottom 0.254: A3.D20 95.25,46.99 95.25,56.39 87.88,63.75 87.88,90.93 92.71,95.76 92.71,113.03 82.15,123.59 82.15,146.03 J3.27
TCU_TX6
  Bottom 0.254: A3.D24 81.53,58.67 81.53,91.44 85.09,95 85.09,113.03 79.17,118.95 J3.32
TCU_TX7
  Bottom 0.254: A3.D29 69.6,59.44 75.69,59.44 78.49,62.23 78.49,91.95 77.47,92.96 77.47,113.03 76.19,114.31 76.19,146.07 J3.33
TELEM_CLK
  Top 0.254: A3.D13 83.82,37.59 67.31,21.08 38.35,21.08 30.99,13.72 19.81,13.72 16.75,16.77 U32.16
TELEM_SDI  (via drill 0.35)
  Top 0.254: U32.15 16.1,16.41 19.56,12.95 31.24,12.95 38.61,20.32 67.56,20.32 85.09,37.85 v85.09,43.18
  Bottom 0.254: v85.09,43.18 85.09,54.61 A3.D12
TELEM_SDO  (via drill 0.35)
  Top 0.254: U32.14 15.45,16.04 19.3,12.19 31.5,12.19 38.86,19.56 67.82,19.56 87.63,39.37 v87.63,43.18
  Bottom 0.254: v87.63,43.18 87.63,54.61 A3.D11
VBAT  (via drill 0.35)  (1 unrouted)
  Top 0.508: XA1.VBAT 74.42,17.27 v58.17,17.27 XB1.1
  Bottom 0.508: A3.VBAT 72.39,52.07 72.39,37.08 73.66,35.81 73.66,32.77 v58.17,17.27
WATCHDOG
  Bottom 0.254: A2.D21 104.14,73.63 U5.4
WATCHDOG_OK  (via drill 0.35)
  Top 0.254: K12.A1 92.01,62.29 D34.C | v116.08,71.37 117.35,70.1 117.35,63.33 R32.1 | v104.39,66.29 v102.36,66.29
  Bottom 0.254: Q5.3 91.45,64.84 K12.A1 94.02,66.29 v102.36,66.29 | v116.08,71.37 109.47,71.37 v104.39,66.29
WATCHDOG_OK_LV
  Bottom 0.254: U5.1 101.32,70.42 R7.2 99.14,69.94 Q6.1 99.05,70.89 D39.3
XBDI  (via drill 0.35)
  Top 0.254: v78.23,52.32 90.42,52.32 A3.D8
  Bottom 0.254: A4.3 77.47,31.99 77.47,51.56 v78.23,52.32
XBDO  (via drill 0.35)
  Top 0.254: v75.69,51.31 91.95,51.31 A3.D7
  Bottom 0.254: A4.2 74.93,31.45 74.93,50.55 v75.69,51.31

## Text on the board
tPlace: HyTech Racing 2023 / Main ECU rev11 / Designed by Mikhail Allen